# Altium project parallella_schematic.PrjPcb (part 3 of 3)

## Sheet 15-HDMI TRNSMITTER.SchDoc
size 513 x 386 mm
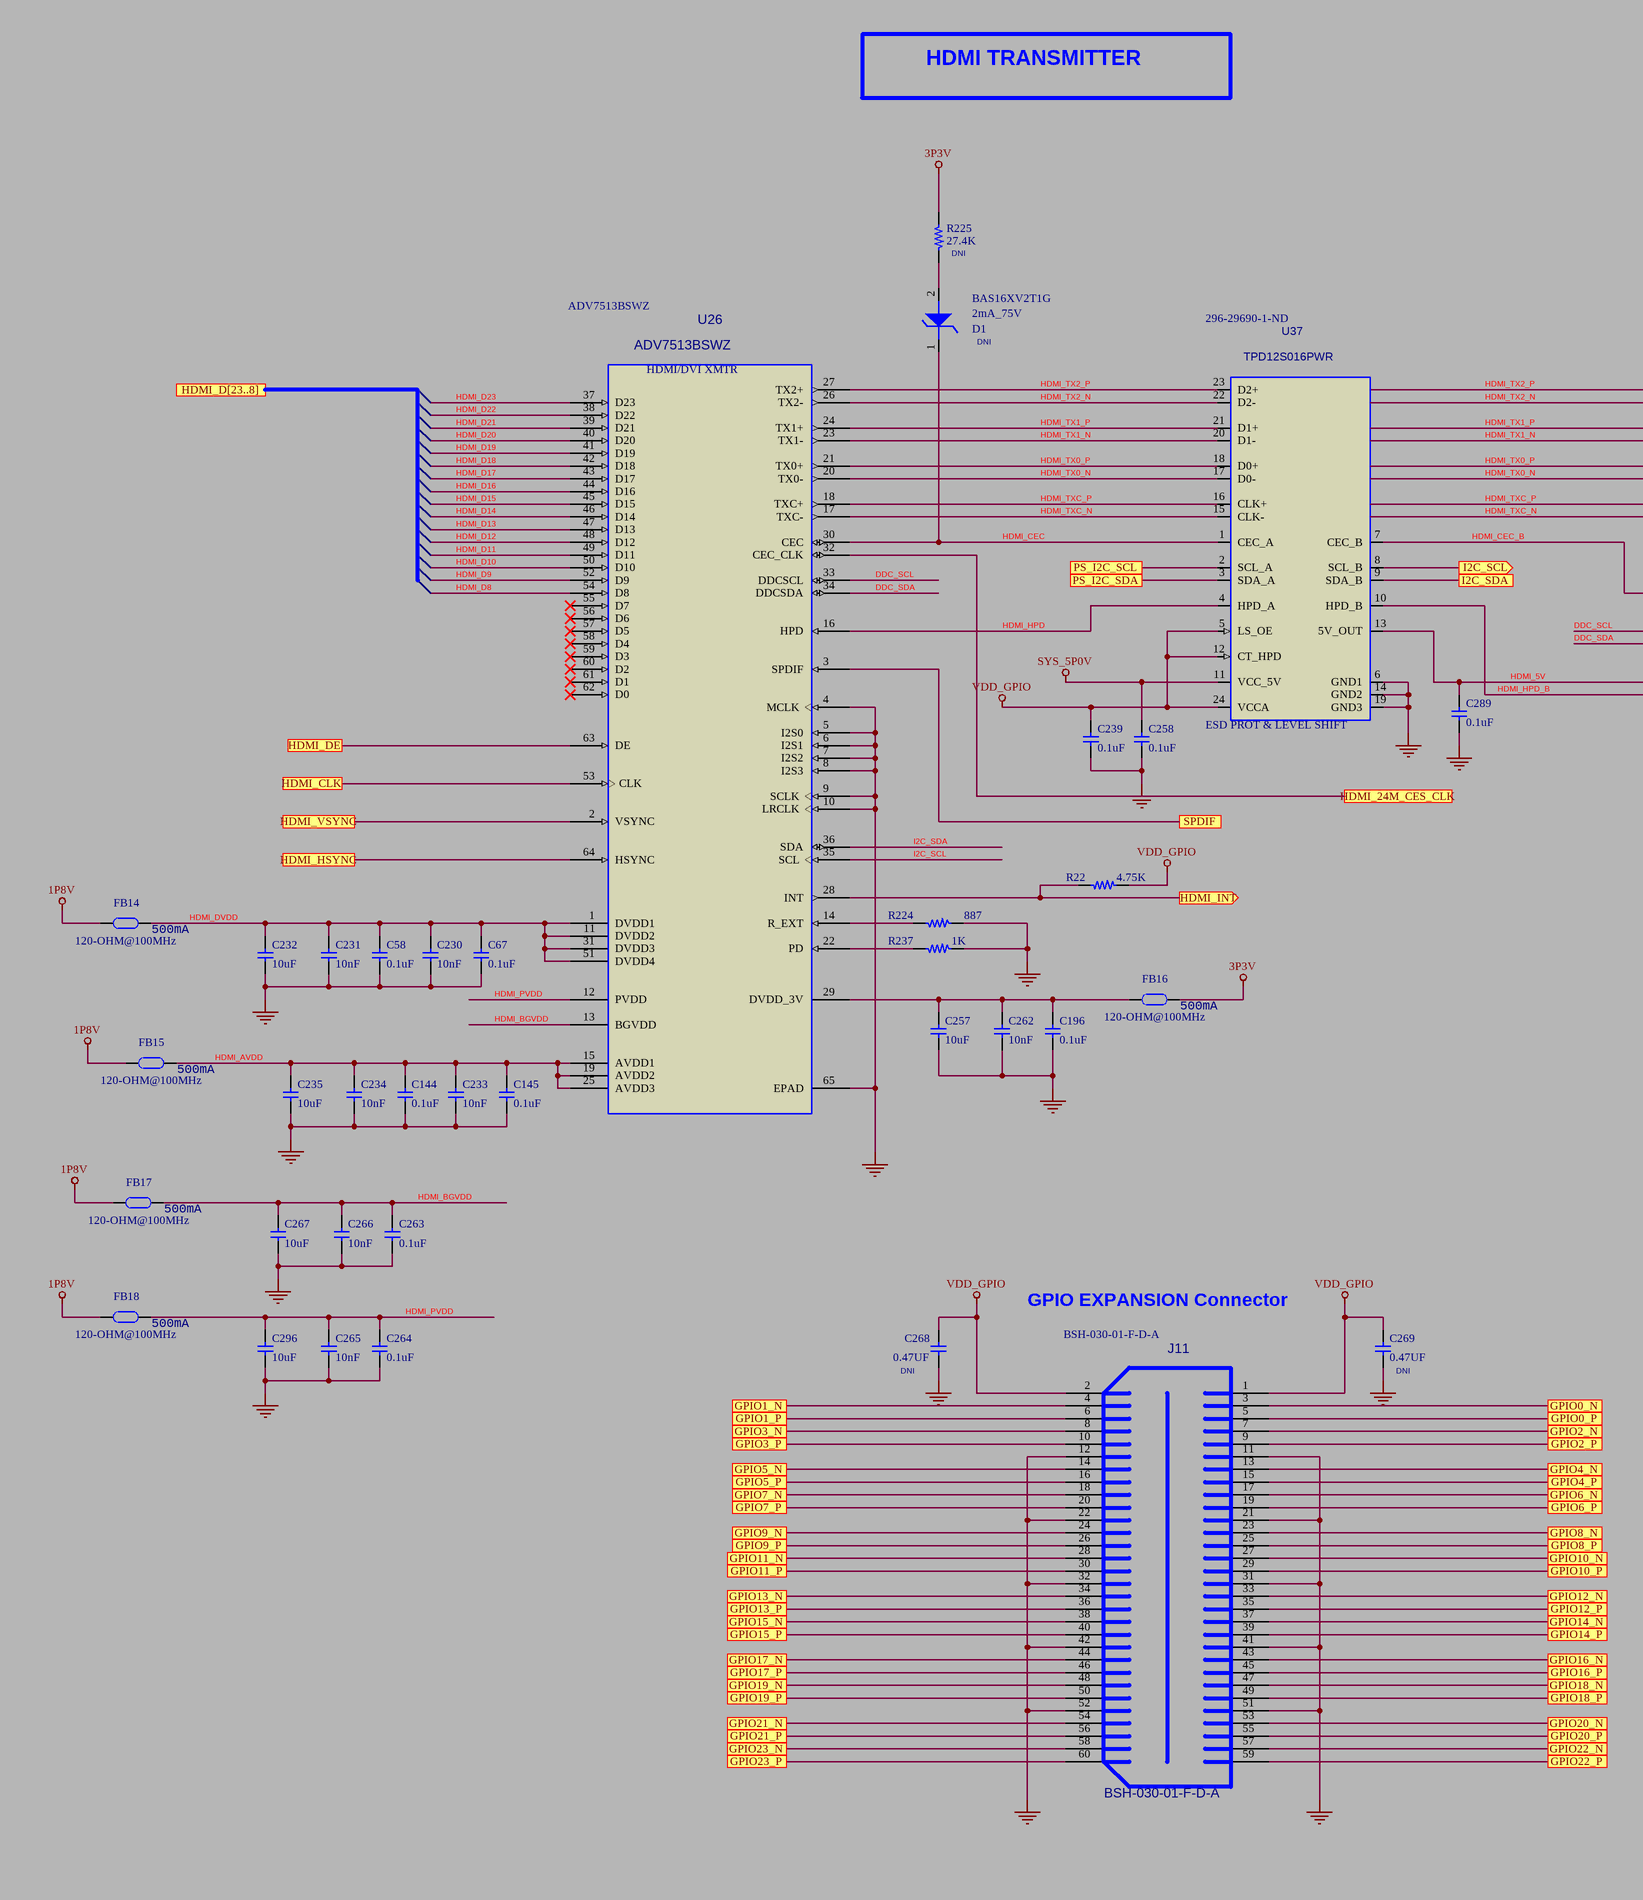
[diagram p19: 15-HDMI TRNSMITTER.SchDoc, left]
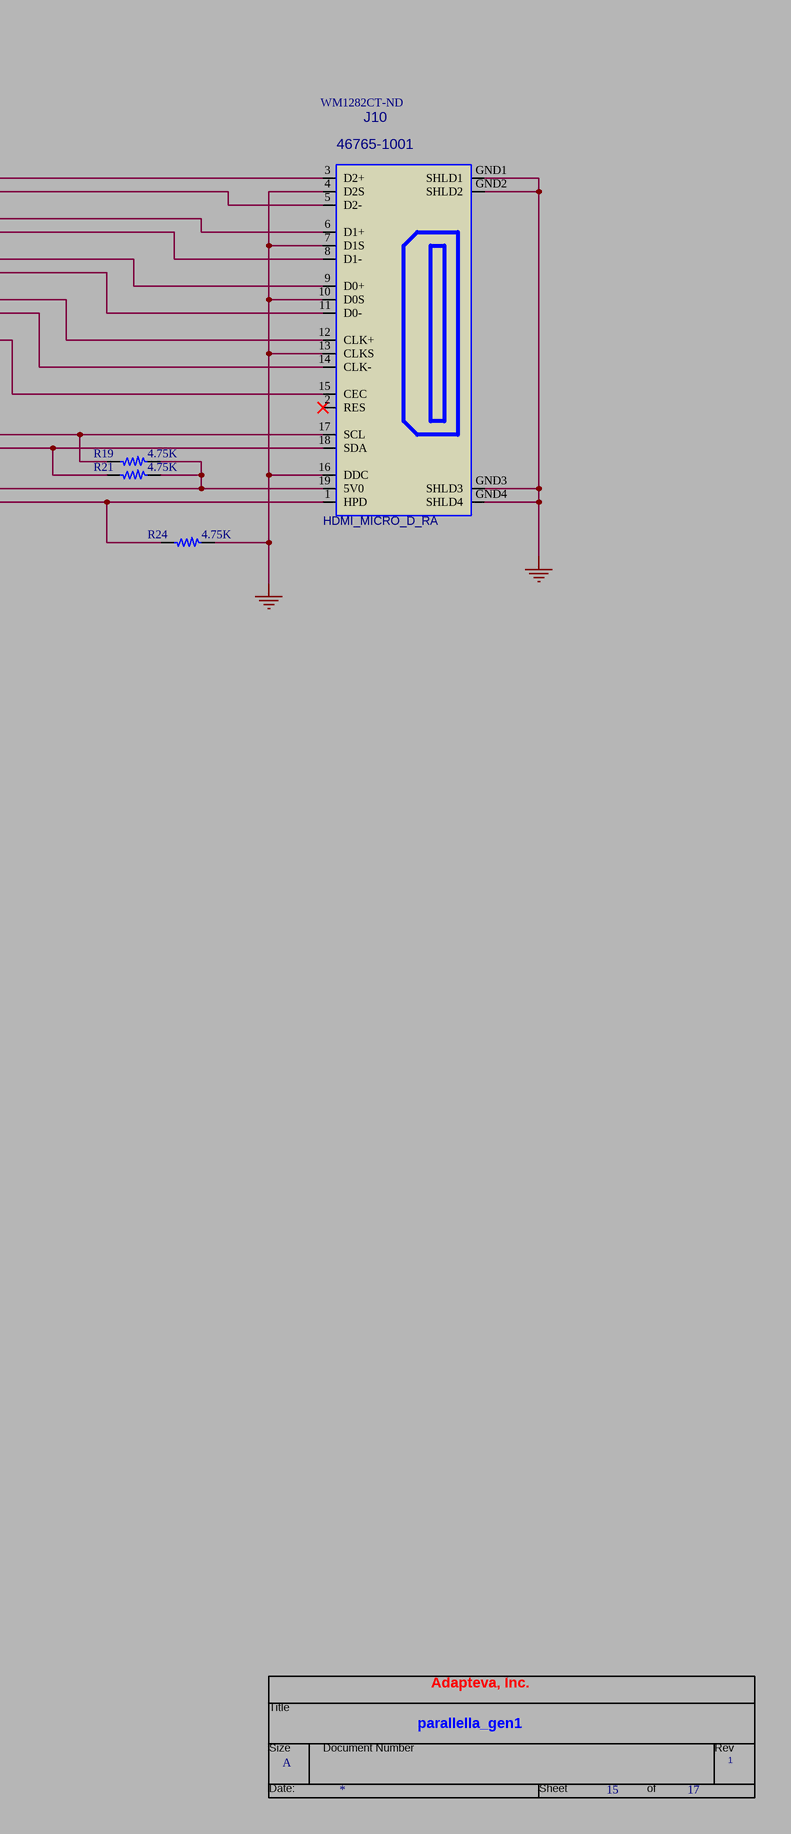
[diagram p20: 15-HDMI TRNSMITTER.SchDoc, right]

### Parts
(Parts that share a designator on the sheet are numbered #1, #2 ... from top to bottom, then left to right.)
*#15  RevCode: 1  Title: parallella_gen1  Page Size: A  Page Number: 15  Page Count: 17  OrgAddr1: Adapteva, Inc.  (hidden comment: TitleBlock0)  (graphical)
C58  0.1uF  [C0402]
C67  0.1uF  [C0402]
C144  0.1uF  [C0402]
C145  0.1uF  [C0402]
C196  0.1uF  [C0402]
C230  10nF  [C0402]
C231  10nF  [C0402]
C232  10uF  [C0603]
C233  10nF  [C0402]
C234  10nF  [C0402]
C235  10uF  [C0603]
C239  0.1uF  [C0402]
C257  10uF  [C0603]
C258  0.1uF  [C0402]
C262  10nF  [C0402]
C263  0.1uF  [C0402]
C264  0.1uF  [C0402]
C265  10nF  [C0402]
C266  10nF  [C0402]
C267  10uF  [C0603]
C268  0.47UF  INSTALL: DNI  [C0402]
C269  0.47UF  INSTALL: DNI  [C0402]
C289  0.1uF  [C0402]
C296  10uF  [C0603]
D1  2mA_75V  Vendor PN: BAS16XV2T1G  INSTALL: DNI  [SOD-523]
FB14  120-OHM@100MHz  [FBEAD_0402]
FB15  120-OHM@100MHz  [FBEAD_0402]
FB16  120-OHM@100MHz  [FBEAD_0402]
FB17  120-OHM@100MHz  [FBEAD_0402]
FB18  120-OHM@100MHz  [FBEAD_0402]
J10  HDMI_MICRO_D_RA  MFG PART NO: 46765-1001  Supplier Part Number 1: WM1282CT-ND  [HDMI_MICRO19_6P5X7P5X2P9H_P4P]
J11  BSH-030-01-F-D-A  [CONN_BSH60P_13P59X25P88_P5P_V]
R19  4.75K  [R0402]
R21  4.75K  [R0402]
R22  4.75K  [R0402]
R24  4.75K  [R0402]
R224  887  [R0402]
R225  27.4K  INSTALL: DNI  [R0402]
R237  1K  [R0402]
U26  HDMI/DVI XMTR  Vendor PN: ADV7513BSWZ  [LQFP64_10SQX1P6MMH_P5MMP]
U37  ESD PROT & LEVEL SHIFT  MFG PART NO: TPD12S016PWR  Supplier Part Number 1: 296-29690-1-ND  [TSSOP24_6P4X7P9X1P2MMH_P65P]

### Ports
GPIO0_N, GPIO0_P, GPIO1_N, GPIO1_P, GPIO2_N, GPIO2_P, GPIO3_N, GPIO3_P, GPIO4_N, GPIO4_P, GPIO5_N, GPIO5_P, GPIO6_N, GPIO6_P, GPIO7_N, GPIO7_P, GPIO8_N, GPIO8_P, GPIO9_N, GPIO9_P, GPIO10_N, GPIO10_P, GPIO11_N, GPIO11_P, GPIO12_N, GPIO12_P, GPIO13_N, GPIO13_P, GPIO14_N, GPIO14_P, GPIO15_N, GPIO15_P, GPIO16_N, GPIO16_P, GPIO17_N, GPIO17_P, GPIO18_N, GPIO18_P, GPIO19_N, GPIO19_P, GPIO20_N, GPIO20_P, GPIO21_N, GPIO21_P, GPIO22_N, GPIO22_P, GPIO23_N, GPIO23_P, HDMI_24M_CES_CLK, HDMI_CLK, HDMI_D[23..8], HDMI_DE, HDMI_HSYNC, HDMI_INT (out), HDMI_VSYNC, I2C_SCL (out), I2C_SDA, PS_I2C_SCL, PS_I2C_SDA, SPDIF

### Nets
1P8V: FB14.1 FB15.1 FB17.1 FB18.1
3P3V: FB16.2 R225.1
GND: C58.2 C67.2 C144.2 C145.2 C196.2 C230.2 C231.2 C232.2 C233.2 C234.2 C235.2 C239.2 C257.2 C258.2 C262.2 C263.2 C264.2 C265.2 C266.2 C267.2 C268.2 C269.2 C289.2 C296.2 J10.4(D2S) J10.7(D1S) J10.10(D0S) J10.13(CLKS) J10.16(DDC) J10.GND1(SHLD1) J10.GND2(SHLD2) J10.GND3(SHLD3) J10.GND4(SHLD4) J11.11 J11.12 J11.21 J11.22 J11.31 J11.32 J11.41 J11.42 J11.51 J11.52 R24.2 R224.2 R237.2 U26.4(MCLK) U26.5(I2S0) U26.6(I2S1) U26.7(I2S2) U26.8(I2S3) U26.9(SCLK) U26.10(LRCLK) U26.65(EPAD) U37.6(GND1) U37.14(GND2) U37.19(GND3)  [project net PHY_DIS_REG10]
SYS_5P0V: C258.1 U37.11(VCC_5V)
VDD_GPIO: C239.1 C268.1 C269.1 J11.1 J11.2 R22.2 U37.5(LS_OE) U37.12(CT_HPD) U37.24(VCCA)
DDC_SCL: J10.17(SCL) R19.1 U26.33(DDCSCL)
DDC_SDA: J10.18(SDA) R21.1 U26.34(DDCSDA)
HDMI_5V: C289.1 J10.19(5V0) R19.2 R21.2 U37.13(5V_OUT)
HDMI_AVDD: C144.1 C145.1 C233.1 C234.1 C235.1 FB15.2 U26.15(AVDD1) U26.19(AVDD2) U26.25(AVDD3)
HDMI_BGVDD: C263.1 C266.1 C267.1 FB17.2 U26.13(BGVDD)
HDMI_CEC: D1.1(CATHODE) U26.30(CEC) U37.1(CEC_A)
HDMI_CEC_B: J10.15(CEC) U37.7(CEC_B)
HDMI_D8: U26.54(D8)
HDMI_D9: U26.52(D9)
HDMI_D10: U26.50(D10)
HDMI_D11: U26.49(D11)
HDMI_D12: U26.48(D12)
HDMI_D13: U26.47(D13)
HDMI_D14: U26.46(D14)
HDMI_D15: U26.45(D15)
HDMI_D16: U26.44(D16)
HDMI_D17: U26.43(D17)
HDMI_D18: U26.42(D18)
HDMI_D19: U26.41(D19)
HDMI_D20: U26.40(D20)
HDMI_D21: U26.39(D21)
HDMI_D22: U26.38(D22)
HDMI_D23: U26.37(D23)
HDMI_DVDD: C58.1 C67.1 C230.1 C231.1 C232.1 FB14.2 U26.1(DVDD1) U26.11(DVDD2) U26.31(DVDD3) U26.51(DVDD4)
HDMI_HPD: U26.16(HPD) U37.4(HPD_A)
HDMI_HPD_B: J10.1(HPD) R24.1 U37.10(HPD_B)
HDMI_PVDD: C264.1 C265.1 C296.1 FB18.2 U26.12(PVDD)
HDMI_TX0_N: J10.11(D0-) U26.20(TX0-) U37.17(D0-)
HDMI_TX0_P: J10.9(D0+) U26.21(TX0+) U37.18(D0+)
HDMI_TX1_N: J10.8(D1-) U26.23(TX1-) U37.20(D1-)
HDMI_TX1_P: J10.6(D1+) U26.24(TX1+) U37.21(D1+)
HDMI_TX2_N: J10.5(D2-) U26.26(TX2-) U37.22(D2-)
HDMI_TX2_P: J10.3(D2+) U26.27(TX2+) U37.23(D2+)
HDMI_TXC_N: J10.14(CLK-) U26.17(TXC-) U37.15(CLK-)
HDMI_TXC_P: J10.12(CLK+) U26.18(TXC+) U37.16(CLK+)
I2C_SCL: U26.35(SCL)
I2C_SDA: U26.36(SDA)
NetC196_1: C196.1 C257.1 C262.1 FB16.1 U26.29(DVDD_3V)
NetD1_2: D1.2(ANODE) R225.2
NetJ11_3: J11.3 ; port GPIO0_N
NetJ11_4: J11.4 ; port GPIO1_N
NetJ11_5: J11.5 ; port GPIO0_P
NetJ11_6: J11.6 ; port GPIO1_P
NetJ11_7: J11.7 ; port GPIO2_N
NetJ11_8: J11.8 ; port GPIO3_N
NetJ11_9: J11.9 ; port GPIO2_P
NetJ11_10: J11.10 ; port GPIO3_P
NetJ11_13: J11.13 ; port GPIO4_N
NetJ11_14: J11.14 ; port GPIO5_N
NetJ11_15: J11.15 ; port GPIO4_P
NetJ11_16: J11.16 ; port GPIO5_P
NetJ11_17: J11.17 ; port GPIO6_N
NetJ11_18: J11.18 ; port GPIO7_N
NetJ11_19: J11.19 ; port GPIO6_P
NetJ11_20: J11.20 ; port GPIO7_P
NetJ11_23: J11.23 ; port GPIO8_N
NetJ11_24: J11.24 ; port GPIO9_N
NetJ11_25: J11.25 ; port GPIO8_P
NetJ11_26: J11.26 ; port GPIO9_P
NetJ11_27: J11.27 ; port GPIO10_N
NetJ11_28: J11.28 ; port GPIO11_N
NetJ11_29: J11.29 ; port GPIO10_P
NetJ11_30: J11.30 ; port GPIO11_P
NetJ11_33: J11.33 ; port GPIO12_N
NetJ11_34: J11.34 ; port GPIO13_N
NetJ11_35: J11.35 ; port GPIO12_P
NetJ11_36: J11.36 ; port GPIO13_P
NetJ11_37: J11.37 ; port GPIO14_N
NetJ11_38: J11.38 ; port GPIO15_N
NetJ11_39: J11.39 ; port GPIO14_P
NetJ11_40: J11.40 ; port GPIO15_P
NetJ11_43: J11.43 ; port GPIO16_N
NetJ11_44: J11.44 ; port GPIO17_N
NetJ11_45: J11.45 ; port GPIO16_P
NetJ11_46: J11.46 ; port GPIO17_P
NetJ11_47: J11.47 ; port GPIO18_N
NetJ11_48: J11.48 ; port GPIO19_N
NetJ11_49: J11.49 ; port GPIO18_P
NetJ11_50: J11.50 ; port GPIO19_P
NetJ11_53: J11.53 ; port GPIO20_N
NetJ11_54: J11.54 ; port GPIO21_N
NetJ11_55: J11.55 ; port GPIO20_P
NetJ11_56: J11.56 ; port GPIO21_P
NetJ11_57: J11.57 ; port GPIO22_N
NetJ11_58: J11.58 ; port GPIO23_N
NetJ11_59: J11.59 ; port GPIO22_P
NetJ11_60: J11.60 ; port GPIO23_P
NetJ13_3: U37.8(SCL_B) ; port I2C_SCL
NetJ13_4: U37.9(SDA_B) ; port I2C_SDA
NetJ13_27: U26.3(SPDIF) ; port SPDIF
NetR18_2: U37.3(SDA_A) ; port PS_I2C_SDA
NetR20_2: U37.2(SCL_A) ; port PS_I2C_SCL
NetR22_1: R22.1 U26.28(INT) ; port HDMI_INT
NetR41_2: U26.53(CLK) ; port HDMI_CLK
NetR42_2: U26.2(VSYNC) ; port HDMI_VSYNC
NetR44_2: U26.64(HSYNC) ; port HDMI_HSYNC
NetR94_2: U26.63(DE) ; port HDMI_DE
NetR114_2: U26.32(CEC_CLK) ; port HDMI_24M_CES_CLK
NetR224_1: R224.1 U26.14(R_EXT)
NetR237_1: R237.1 U26.22(PD)

Not connected (* = marked no-connect by the designer): J10 2(RES)*; U26 55(D7)* 56(D6)* 57(D5)* 58(D4)* 59(D3)* 60(D2)* 61(D1)* 62(D0)*

### Notes on the sheet
- HDMI TRANSMITTER
- GPIO EXPANSION Connector
- (in symbol BLM15AG121SN1D) 500mA
- (in symbol TitleBlock0) Title; Size; Document Number; Rev; Date:; Sheet; of

### Library data of the parts
C58 C67 C144 C145 C196 C239 C258 C263 C264 C289 = CAP0402_0P1UF_X5R_35V: as C297 on sheet 11-DSP PROCESSOR 1-OF-3; DEVICE: CAP0402_0P1UF_X5R_35V; MFG PART NO: GMK105BJ104KV-F; MFG: TAIYO YUDEN; PCB Footprint: C0402
C230 C231 C233 C234 C262 C265 C266 = CAP0402_10NF_X7R_16V: CAP, 0402, 10NF, X7R, 16V; MFG PART NO: C1005X7R1C103K; MFG: TDK; ALT_SYMBOLS: C0402_BGA; Vendor: TDK; Vendor PN: C1005X7R1C103K; PCB Footprint: C0402
C232 C235 C257 C267 C296 = CAP0603_10UF_X5R: CAP, 0603, 10UF, X5R, 10V; MFG PART NO: LMK107BJ106MALTD; MFG: TAIYO YUDEN; DEVICE: CAP0603_10UF_X5R; Vendor: TAIYO YUDEN; Vendor PN: LMK107BJ106MALTD; PCB Footprint: C0603
C268 C269 = CAP0402_0P47UF_X5R: as C154-C160 on sheet 10-ZYNQ PWR & GND; DEVICE: CAP0402_0P47UF_X5R; Vendor: TDK; Vendor PN: C1005X5R1C474K; PCB Footprint: C0402
D1 = DIODE_BAS16XV2T1G: DIODE, SWITCH, 200mA, 75V, SOD523; MFG: ON SEMICONDUCTOR; MFG PART NO: BAS16XV2T1G; DEVICE: DIODE_BAS16XV2T1G; Vendor: ON SEMICONDUCTOR; PCB Footprint: SOD-523
FB14-FB18 = BLM15AG121SN1D: FERRITE, BEAD, 0402, 120 OHM@ 100MHZ, 500mA, SMT; Vendor: MURATA; Vendor PN: BLM15AG121SN1D; DEVICE: BLM15AG121SN1D; MFG: MURATA; MFG PART NO: BLM15AG121SN1D; PCB Footprint: FBEAD_0402
J10 = HDMI_MICRO_D_RA_SMT: CONN, HDMI, RCPT, MICRO D, RA, SMT; Vendor: MOLEX; Vendor PN: 46765-1001; DEVICE: HDMI_MICRO_D_RA_SMT; MFG: MOLEX; PCB Footprint: HDMI_MICRO19_6P5X7P5X2P9H_P4P; Supplier 1: Digi-Key
J11 = CON_BSH_030_VERT: Vendor: SAMTEC; Vendor PN: BSH-030-01-F-D-A; DEVICE: CON_BSH_030_VERT; PCB Footprint: CONN_BSH60P_13P59X25P88_P5P_V; Supplier 1: Arrow; Supplier Part Number 1: BSH-030-01-F-D-A
R19 R21 R22 R24 = RES0402_4K75: as R156-R159 on sheet 11-DSP PROCESSOR 1-OF-3; DEVICE: RES0402_4K75; Vendor PN: CRCW04024K75FKED; PCB Footprint: R0402
R224 = RES0402_887: RES, 0402, 887; Vendor PN: CRCW0402887RFKED; Vendor: VISHAY/DALE; MFG: VISHAY; ALY_SYMBOLS: R0402_BGA; MFG PART NO: CRCW0402887RFKED; DEVICE: RES0402_887; PCB Footprint: R0402
R225 = RES0402_27K4: RES, 0402, 27.4K; Vendor PN: CRCW040227K4FKED; Vendor: VISHAY/DALE; MFG: VISHAY; ALT_SYMBOLS: R0402_BGA; MFG PART NO: CRCW040227K4FKED; DEVICE: RES0402_27K4; PCB Footprint: R0402
R237 = RES0402_1K: as R160 on sheet 11-DSP PROCESSOR 1-OF-3; DEVICE: RES0402_1K; Vendor PN: CRCW04021K00FKED; PCB Footprint: R0402
U26 = HDMI_DVI_XCVR_ADV7513: IC, HDMI/DVI TRANSMITTER, PQFP64; Vendor: ANALOG DEVICES; DEVICE: HDMI_DVI_XCVR_ADV7513; Supplier 1: Arrow; Supplier Part Number 1: ADV7513BSWZ
U37 = TPD12S016: IC, HDMI ESD PROT AND LEVEL SHIFT, TSSOP24; Vendor: TEXAS INSTRUMENTS; Vendor PN: TPD12S016PWR; DEVICE: TPD12S016; MFG: TEXAS INSTRUMENTS; PCB Footprint: TSSOP24_6P4X7P9X1P2MMH_P65P; Supplier 1: Digi-Key
*#15 = TitleBlock0: Page Create Date: March  8, 1995; Page Modify Date: *

## Sheet 16-POWER MANAGEMENT.SchDoc
size 513 x 386 mm
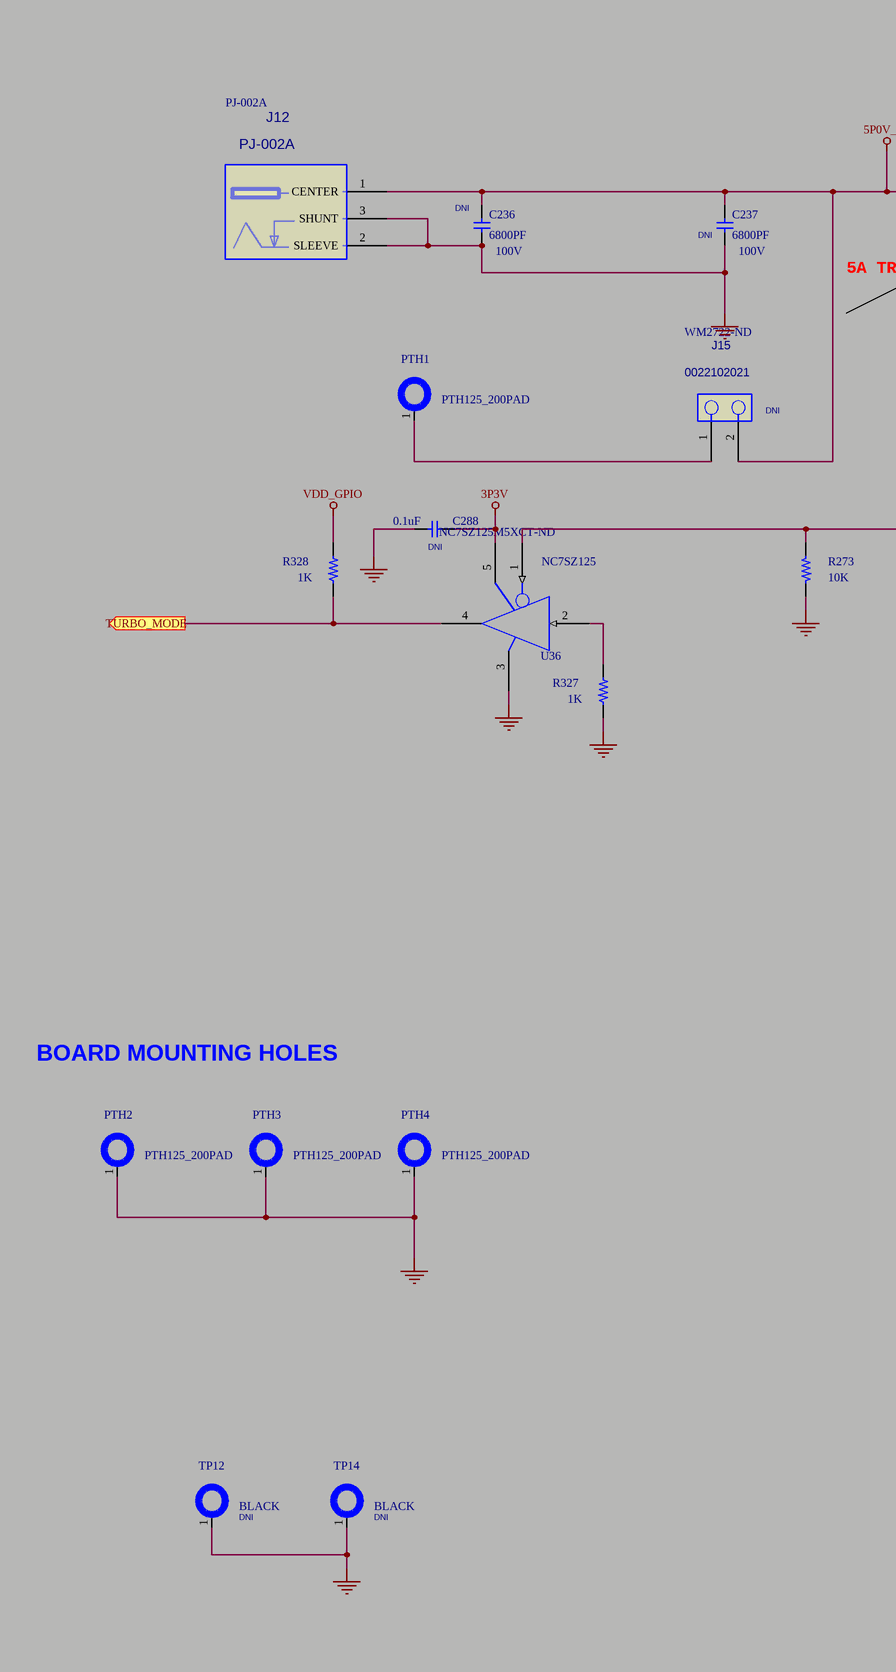
[diagram p21: 16-POWER MANAGEMENT.SchDoc, left]
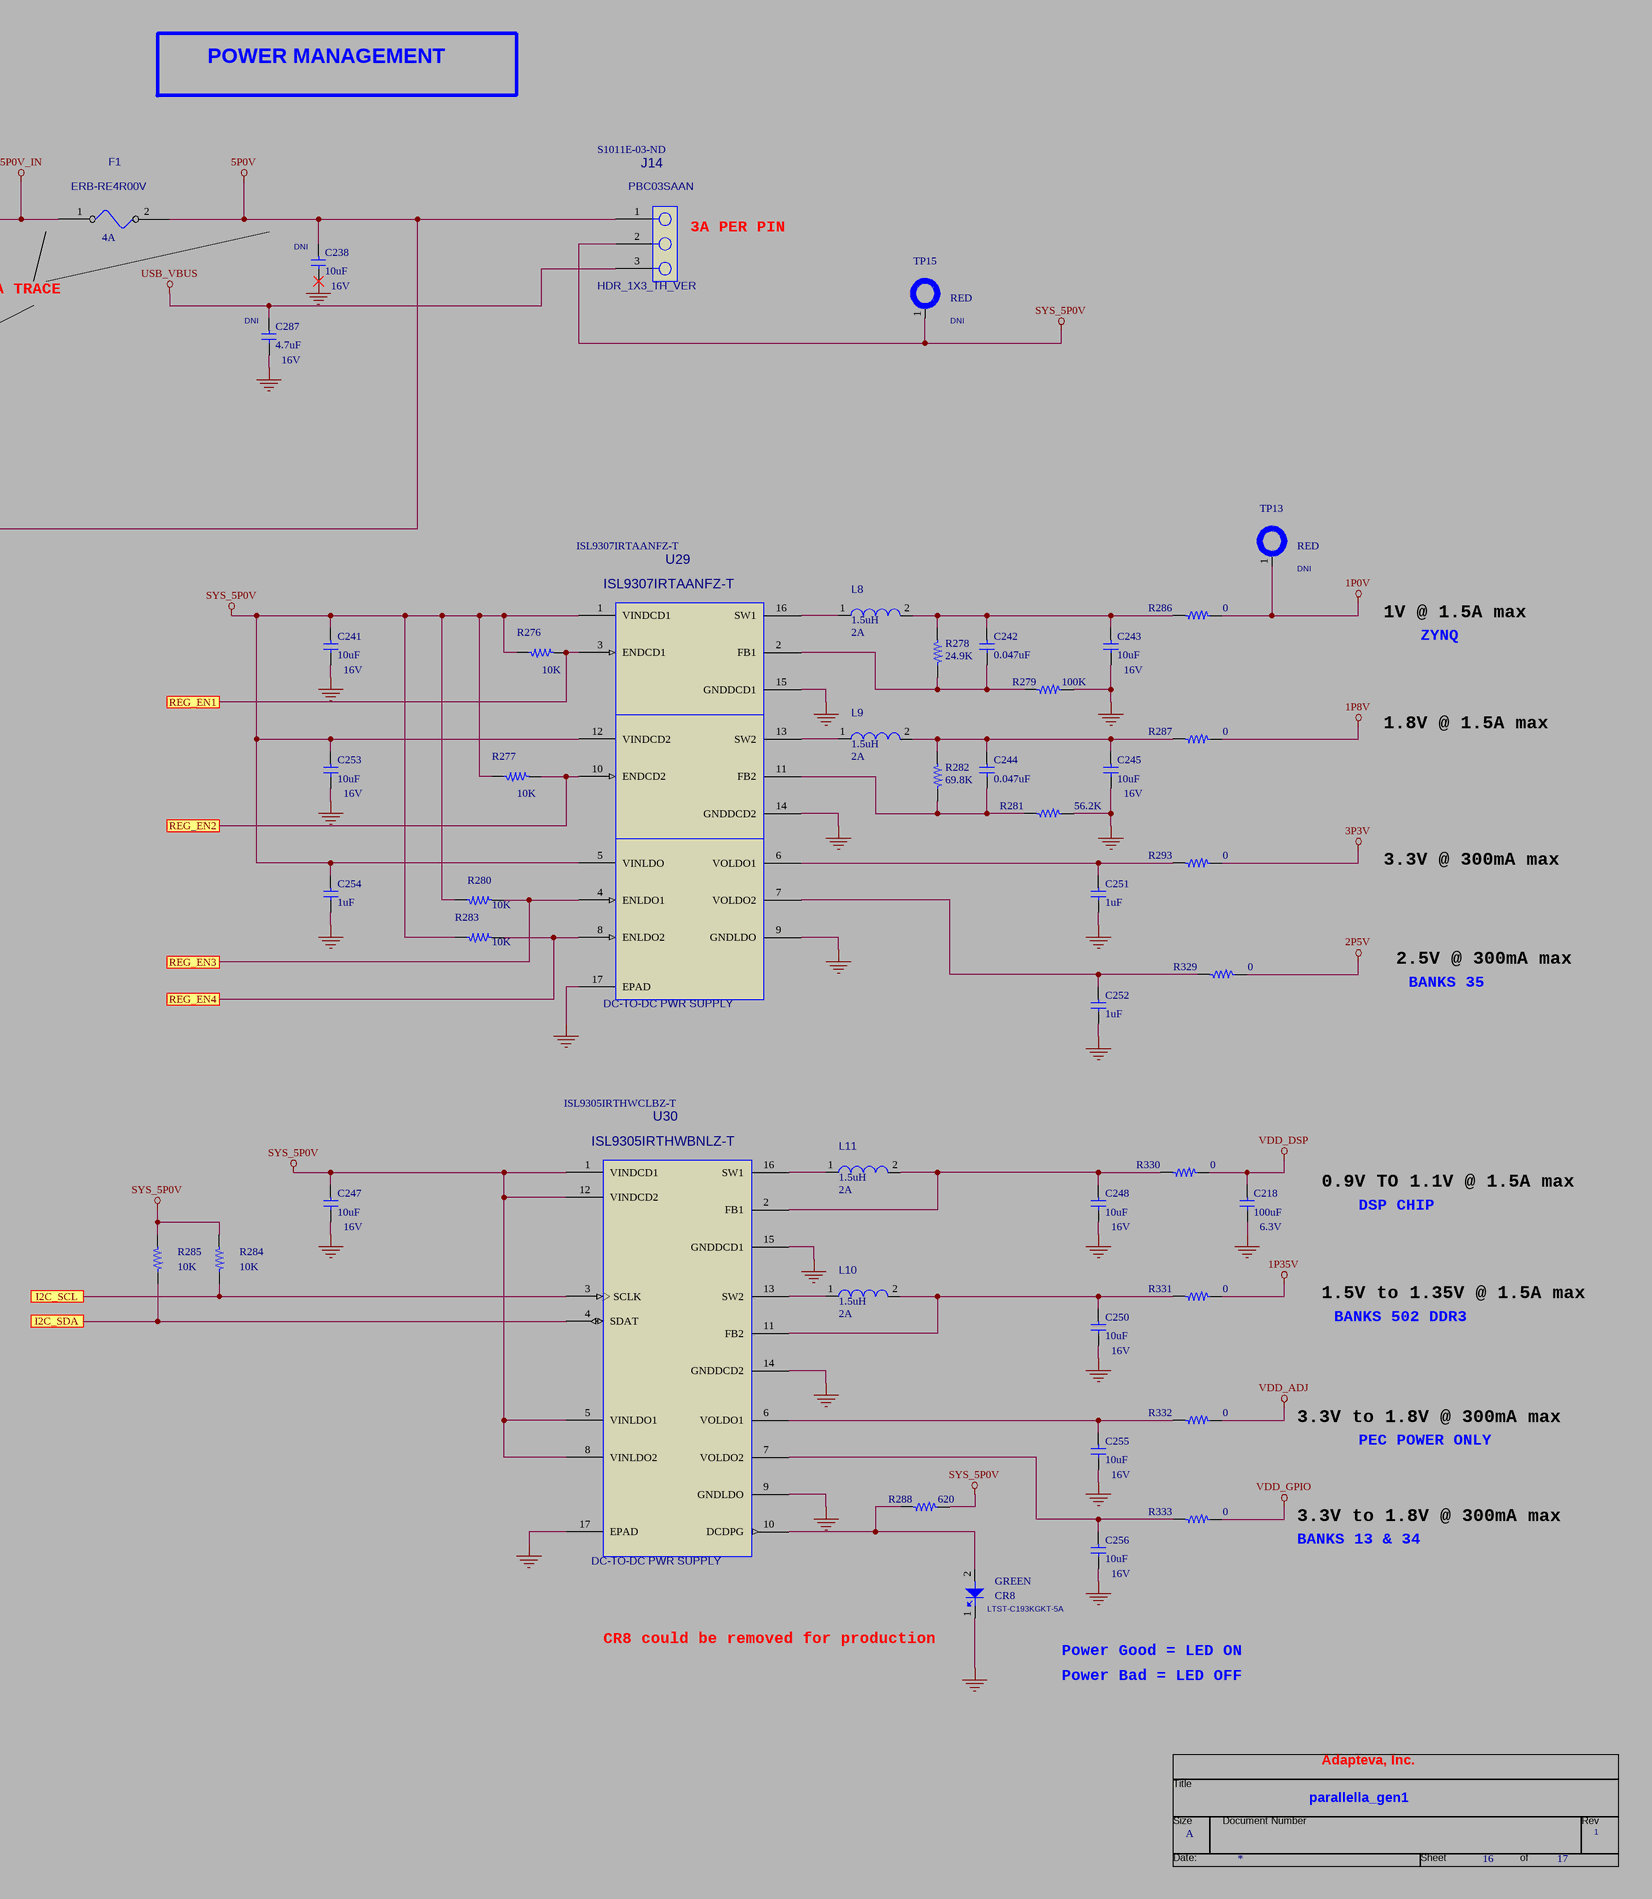
[diagram p22: 16-POWER MANAGEMENT.SchDoc, right]

### Parts
(Parts that share a designator on the sheet are numbered #1, #2 ... from top to bottom, then left to right.)
*#16  RevCode: 1  Title: parallella_gen1  Page Size: A  Page Number: 16  Page Count: 17  OrgAddr1: Adapteva, Inc.  (hidden comment: TitleBlock0)  (graphical)
C218  100uF  VOLTAGE: 6.3V  [C1210]
C236  6800PF  VOLTAGE: 100V  INSTALL: DNI  [C0805]
C237  6800PF  VOLTAGE: 100V  INSTALL: DNI  [C0805]
C238  10uF  VOLTAGE: 16V  INSTALL: DNI  [C0805]
C241  10uF  VOLTAGE: 16V  [C0805]
C242  0.047uF  [C0402]
C243  10uF  VOLTAGE: 16V  [C0805]
C244  0.047uF  [C0402]
C245  10uF  VOLTAGE: 16V  [C0805]
C247  10uF  VOLTAGE: 16V  [C0805]
C248  10uF  VOLTAGE: 16V  [C0805]
C250  10uF  VOLTAGE: 16V  [C0805]
C251  1uF  [C0603]
C252  1uF  [C0603]
C253  10uF  VOLTAGE: 16V  [C0805]
C254  1uF  [C0603]
C255  10uF  VOLTAGE: 16V  [C0805]
C256  10uF  VOLTAGE: 16V  [C0805]
C287  4.7uF  VOLTAGE: 16V  INSTALL: DNI  [C0603]
C288  0.1uF  INSTALL: DNI  [C0402]
CR8  GREEN  Vendor PN: LTST-C193KGKT-5A  [LED_0603]
F1  4A  Vendor PN: ERB-RE4R00V  [F0603]
J12  PJ-002A  [DC_PWR_JCK_9X14P4X11MMH]
J14  HDR_1X3_TH_VER  Vendor PN: PBC03SAAN  Supplier Part Number 1: S1011E-03-ND  [HDR_1X3_TH_VER]
J15  Vendor PN: 0022102021  INSTALL: DNI  Supplier Part Number 1: WM2722-ND  [HDR_1X2_TH_VER]  (hidden comment: HDR_1X2_TH_VER)
L8  1.5uH  CURRENT: 2A  [IND2_2X2P5X1P2MMH]
L9  1.5uH  CURRENT: 2A  [IND2_2X2P5X1P2MMH]
L10  1.5uH  CURRENT: 2A  [IND2_2X2P5X1P2MMH]
L11  1.5uH  CURRENT: 2A  [IND2_2X2P5X1P2MMH]
PTH1  PTH125_200PAD  [PTH125_200PAD]
PTH2  PTH125_200PAD  [PTH125_200PAD]
PTH3  PTH125_200PAD  [PTH125_200PAD]
PTH4  PTH125_200PAD  [PTH125_200PAD]
R273  10K  [R0402]
R276  10K  [R0402]
R277  10K  [R0402]
R278  24.9K  [R0603]
R279  100K  [R0603]
R280  10K  [R0402]
R281  56.2K  [R0402]
R282  69.8K  [R0603]
R283  10K  [R0402]
R284  10K  [R0402]
R285  10K  [R0402]
R286  0  [R0402]
R287  0  [R0402]
R288  620  [R0402]
R293  0  [R0402]
R327  1K  [R0402]
R328  1K  [R0402]
R329  0  [R0402]
R330  0  [R0402]
R331  0  [R0402]
R332  0  [R0402]
R333  0  [R0402]
TP12  BLACK  INSTALL: DNI  [TP55]
TP13  RED  INSTALL: DNI  [TP55]
TP14  BLACK  INSTALL: DNI  [TP55]
TP15  RED  INSTALL: DNI  [TP55]
U29  DC-TO-DC PWR SUPPLY  Vendor PN: ISL9307IRTAANFZ-T  [TQFN16_4SQXP75H_P65P]
U30  DC-TO-DC PWR SUPPLY  Vendor PN: ISL9305IRTHWBNLZ-T  Supplier Part Number 1: ISL9305IRTHWCLBZ-T  [TQFN16_4SQXP75H_P65P]
U36  NC7SZ125  Supplier Part Number 1: NC7SZ125M5XCT-ND  [SOT_5PIN]

### Ports
I2C_SCL, I2C_SDA, REG_EN1, REG_EN2, REG_EN3, REG_EN4, TURBO_MODE (out)

### Nets
1P0V: R286.2 TP13.1
1P8V: R287.2
1P35V: R331.2
2P5V: R329.2
3P3V: C288.2 R293.2 U36.5(VCC)
5P0V: C238.1 F1.2 J14.1 R273.1 U36.1(~{OE})
5P0V_IN: C236.1 C237.1 F1.1 J12.1(CENTER) J15.2
GND: C218.2 C236.2 C237.2 C238.2 C241.2 C243.2 C245.2 C247.2 C248.2 C250.2 C251.2 C252.2 C253.2 C254.2 C255.2 C256.2 C287.2 C288.1 CR8.1(C) J12.2(SLEEVE) J12.3(SHUNT) PTH2.1 PTH3.1 PTH4.1 R273.2 R279.2 R281.2 R327.2 TP12.1 TP14.1 U29.9(GNDLDO) U29.14(GNDDCD2) U29.15(GNDDCD1) U29.17(EPAD) U30.9(GNDLDO) U30.14(GNDDCD2) U30.15(GNDDCD1) U30.17(EPAD) U36.3(GND)  [project net PHY_DIS_REG10]
SYS_5P0V: C241.1 C247.1 C253.1 C254.1 J14.2 R276.2 R277.2 R280.2 R283.2 R284.1 R285.1 R288.2 TP15.1 U29.1(VINDCD1) U29.5(VINLDO) U29.12(VINDCD2) U30.1(VINDCD1) U30.5(VINLDO1) U30.8(VINLDO2) U30.12(VINDCD2)
USB_VBUS: C287.1 J14.3  [project net P1_VBUS]
VDD_ADJ: R332.2
VDD_DSP: C218.1 R330.2
VDD_GPIO: R328.1 R333.2
NetC242_1: C242.1 C243.1 L8.2 R278.1 R286.1
NetC242_2: C242.2 R278.2 R279.1 U29.2(FB1)
NetC244_1: C244.1 C245.1 L9.2 R282.1 R287.1
NetC244_2: C244.2 R281.1 R282.2 U29.11(FB2)
NetC248_1: C248.1 L11.2 R330.1 U30.2(FB1)
NetC250_1: C250.1 L10.2 R331.1 U30.11(FB2)
NetC251_1: C251.1 R293.1 U29.6(VOLDO1)
NetC252_1: C252.1 R329.1 U29.7(VOLDO2)
NetC255_1: C255.1 R332.1 U30.6(VOLDO1)
NetC256_1: C256.1 R333.1 U30.7(VOLDO2)
NetCR8_2: CR8.2(A) R288.1 U30.10(DCDPG)
NetJ13_3: R284.2 U30.3(SCLK) ; port I2C_SCL
NetJ13_4: R285.2 U30.4(SDAT) ; port I2C_SDA
NetJ13_5: R276.1 U29.3(ENDCD1) ; port REG_EN1
NetJ13_6: R277.1 U29.10(ENDCD2) ; port REG_EN2
NetJ13_7: R280.1 U29.4(ENLDO1) ; port REG_EN3
NetJ13_8: R283.1 U29.8(ENLDO2) ; port REG_EN4
NetJ13_25: R328.2 U36.4(Y) ; port TURBO_MODE
NetJ15_1: J15.1 PTH1.1
NetL8_1: L8.1 U29.16(SW1)
NetL9_1: L9.1 U29.13(SW2)
NetL10_1: L10.1 U30.13(SW2)
NetL11_1: L11.1 U30.16(SW1)
NetR327_1: R327.1 U36.2(A)

### Notes on the sheet
- POWER MANAGEMENT
- (near J14) 3A PER PIN
- 5A TRACE
- 1V @ 1.5A max
- ZYNQ
- 1.8V @ 1.5A max
- 3.3V @ 300mA max
- 2.5V @ 300mA max
- BOARD MOUNTING HOLES
- BANKS 35
- 0.9V TO 1.1V @ 1.5A max
- DSP CHIP
- 1.5V to 1.35V @ 1.5A max
- BANKS 502 DDR3
- 3.3V to 1.8V @ 300mA max
- PEC POWER ONLY
- BANKS 13 & 34
- CR8 could be removed for production
- Power Good = LED ON
- Power Bad = LED OFF
- (in symbol TitleBlock0) Title; Size; Document Number; Rev; Date:; Sheet; of

### Library data of the parts
C218 = CAP1210_100UF_X5R_LOESR: CAP, 1210, 100UF, X5R, 6.3V, LOW ESR; MFG PART NO: GRM32ER60J107ME20L; MFG: MURATA; DEVICE: CAP1210_100UF_X5R_LOESR; Vendor: MURATA; Vendor PN: GRM32ER60J107ME20L; PCB Footprint: C1210
C236 C237 = CAP0805_6800PF_X7R: CAP, 0805, 6800PF, X7R, 100V; MFG PART NO: C2012X7R2A682KT5; MFG: TDK; DEVICE: CAP0805_6800PF_X7R; Vendor: TDK; Vendor PN: C2012X7R2A682KT5; PCB Footprint: C0805
C238 C241 C243 C245 C247 C248 C250 C253 C255 C256 = CAP0805_10UF_16V_X5R: CAP, 0805, 10UF, X5R, 16V; MFG PART NO: C2012X5R1C106M085AC; MFG: TDK; DEVICE: CAP0805_10UF_16V_X5R; Vendor: TDK; Vendor PN: C2012X5R1C106M085AC; PCB Footprint: C0805
C242 C244 = CAP0402_0P047UF_X5R: CAP, 0402, 0.047UF, X5R, 25V; MFG PART NO: C1005X5R1E473M; MFG: TDK; DEVICE: CAP0402_0P047UF_X5R; Vendor: TDK; Vendor PN: C1005X5R1E473M; PCB Footprint: C0402
C251 C252 C254 = CAP1UF_X5R: CAP, 0603, 1UF, X5R, 16V; Vendor PN: C0603C105K4PAC; Vendor: KEMET; DEVICE: CAP0603; MFG PART NO: C0603C105K4PAC; MFG: KEMET; PCB Footprint: C0603
C287 = CAP0603_4P7UF_16V_X5R: CAP, 0603, 4.7UF, X5R, 16V; MFG PART NO: C1608X5R1C475K080AC; MFG: TDK; DEVICE: CAP0603_4P7UF_16V_X5R; Vendor: TDK; Vendor PN: C1608X5R1C475K080AC; PCB Footprint: C0603
C288 = CAP0402_0P1UF_X5R_35V: CAP, 0402, 0.1UF, X5R, 35V; ALT_SYMBOLS: C0402_BGA; Vendor PN: GMK105BJ104KV-F; Vendor: TAIYO YUDEN; DEVICE: CAP0402_0P1UF_X5R_35V; MFG PART NO: GMK105BJ104KV-F; MFG: TAIYO YUDEN; PCB Footprint: C0402
CR8 = LED_0603_5MA_GRN: LED, 0603, 5MA, SMT, GREEN; Voltage: 2V; MFG: LITE-ON INC; MFG PART NO: LTST-C193KGKT-5A; Vendor: LITE-ON INC; PCB Footprint: LED_0603
F1 = FUSE0603_4A: FUSE, 4A, 32V, FAST, 0603; Vendor: PANASONIC; MFG PART NO: ERB-RE4R00V; MFG: PANASONIC; DEVICE: FUSE0603_4A; PCB Footprint: F0603
J12 = CON_POWER_PJ002A_TH: CON, PWR, BARREL, PCB, PJ002A_TH; Vendor: CUI; DEVICE: CON_POWER_PJ002A_TH; Vendor PN: PJ-002A; PCB Footprint: DC_PWR_JCK_9X14P4X11MMH; Supplier 1: Arrow; Supplier Part Number 1: PJ-002A
J14 = HDR_1X3_TH_VER_0.1P: HDR, 1ROW, 3POS, VERT, TH, 1X3, 0.100 PITCH; MFG PART NO: PBC36SAAN; Vendor: SULLINS; MFG: SULLINS; DEVICE: HDR_1X3_TH_VER_0.1P; PCB Footprint: HDR_1X3_TH_VER; Supplier 1: Digi-Key
J15 = HDR_1X2_TH_VER: HDR, 1ROW, 2POS, VERT, TH, 1X2; MFG: MOLEX; DEVICE: HDR_1X2_TH_VER; MFG PART NO: 0022102021; Vendor: MOLEX; PCB Footprint: HDR_1X2_TH_VER; Supplier 1: Digi-Key
L8-L11 = IND_1P5UH_2A: IND, 1.5uH, 2A; MFG PART NO: VLS252012ET-1R5N; MFG: TDK; DEVICE: IND_1P5UH_2A; Vendor: TDK; Vendor PN: VLS252012ET-1R5N; PCB Footprint: IND2_2X2P5X1P2MMH
R273 R276 R277 R280 R283-R285 = RES0402_10K: RES, 0402, 10K; MFG PART NO: CRCW040210K0FKED; ALT_SYMBOLS: R0402_BGA; MFG: VISHAY; Vendor: VISHAY/DALE; DEVICE: RES0402_10K; Vendor PN: CRCW040210K0FKED; PCB Footprint: R0402
R278 = RES0603_24K9: RES, 0603, 24.9K; Vendor PN: CRCW060324K9FKEA; Vendor: VISHAY/DALE; MFG PART NO: CRCW060324K9FKEA; MFG: VISHAY/DALE; DEVICE: RES0603_24K9; PCB Footprint: R0603
R279 = RES0603_100K: RES, 0603, 100K; Vendor PN: CRCW0603100KFKEA; Vendor: VISHAY/DALE; MFG: VISHAY/DALE; MFG PART NO: CRCW0603100KFKEA; DEVICE: RES0603_100K; PCB Footprint: R0603
R281 = RES0402_56K2: RES, 0402, 56.2K; Vendor PN: CRCW040256K2FKED; Vendor: VISHAY/DALE; MFG: VISHAY; ALY_SYMBOLS: R0402_BGA; MFG PART NO: CRCW040256K2FKED; DEVICE: RES0402_56K2; PCB Footprint: R0402
R282 = RES0603_69K8: RES, 0603, 69.8K; MFG PART NO: CRCW060369K8FKEA; MFG: VISHAY; DEVICE: RES0603_69K8; Vendor: VISHAY; Vendor PN: CRCW060369K8FKEA; PCB Footprint: R0603
R286 R287 R293 R329-R333 = RES0402_0: RES, 0402, 0 OHM, 1%; MFG PART NO: CRCW04020000Z0ED; ALT_SYMBOLS: R0402_BGA; MFG: VISHAY; Vendor: VISHAY/DALE; DEVICE: RES0402_0; Vendor PN: CRCW04020000Z0ED; PCB Footprint: R0402
R288 = RES0402_620: RES, 0402, 620, 1%; MFG PART NO: CRCW0402620RFKED; ALT_SYMBOLS: R0402_BGA; MFG: VISHAY; Vendor: VISHAY/DALE; DEVICE: RES0402_620; Vendor PN: CRCW0402620RFKED; PCB Footprint: R0402
R327 R328 = RES0402_1K: RES, 0402, 1K; MFG PART NO: CRCW04021K00FKED; ALT_SYMBOLS: R0402_BGA; MFG: VISHAY; Vendor: VISHAY/DALE; DEVICE: RES0402_1K; Vendor PN: CRCW04021K00FKED; PCB Footprint: R0402
TP12 TP14 = TEST_TERM_BLK: PC Test Point Miniature; Vendor PN: 5001; Vendor: Keystone; CLASS: IC; DEVICE: TEST_TERM_BLK; MFG: KEYSTONE; MFG PART NO: 5001; PCB Footprint: TP55
TP13 TP15 = TEST_TERM_RED: PC TEST POINT MINIATURE; MFG PART NO: 5000; MFG: KEYSTONE; CLASS: IC; DEVICE: TEST_TERM_RED; Vendor: KEYSTONE; Vendor PN: 5000; PCB Footprint: TP55
U29 = IC_ISL9307_DCDC_CONV: IC, dual step-down converters + dual LDOs, TQFN16; MFG: INTERSIL; MFG PART NO: ISL9307IRTAANFZ-T; Vendor: INTERSIL; DEVICE: IC_ISL9307_DCDC_CONV; PCB Footprint: TQFN16_4SQXP75H_P65P; Supplier 1: Avnet; Supplier Part Number 1: ISL9307IRTAANFZ-T
U30 = IC_ISL9305_DCDC_CONV: IC, dual step-down converters + dual LDOs, I2C interface, TQFN16; MFG: INTERSIL; MFG PART NO: ISL9305IRTHWCLBZ-T; Vendor: INTERSIL; DEVICE: IC_ISL9305_DCDC_CONV; PCB Footprint: TQFN16_4SQXP75H_P65P; Supplier 1: Avnet
U36 = NC7SZ125: PART_NUMBER: XXX-XXXXX-XX; Vendor PN: NC7SZ125M5X; VENDOR: FAIRCHILD; CLASS: IC; VENDOR_PN: NC7SZ125M5X; DEVICE: NC7SZ125; MFG: FAIRCHILD; MFG PART NO: NC7SZ125M5X; PCB Footprint: SOT_5PIN; Supplier 1: Digi-Key
*#16 = TitleBlock0: Page Create Date: March  8, 1995; Page Modify Date: *
PTH1-PTH4 = PTH125_200PAD: DEVICE: PTH125_200PAD; PCB Footprint: PTH125_200PAD

## Sheet 17-RESET GENERATION.SchDoc
size 513 x 386 mm
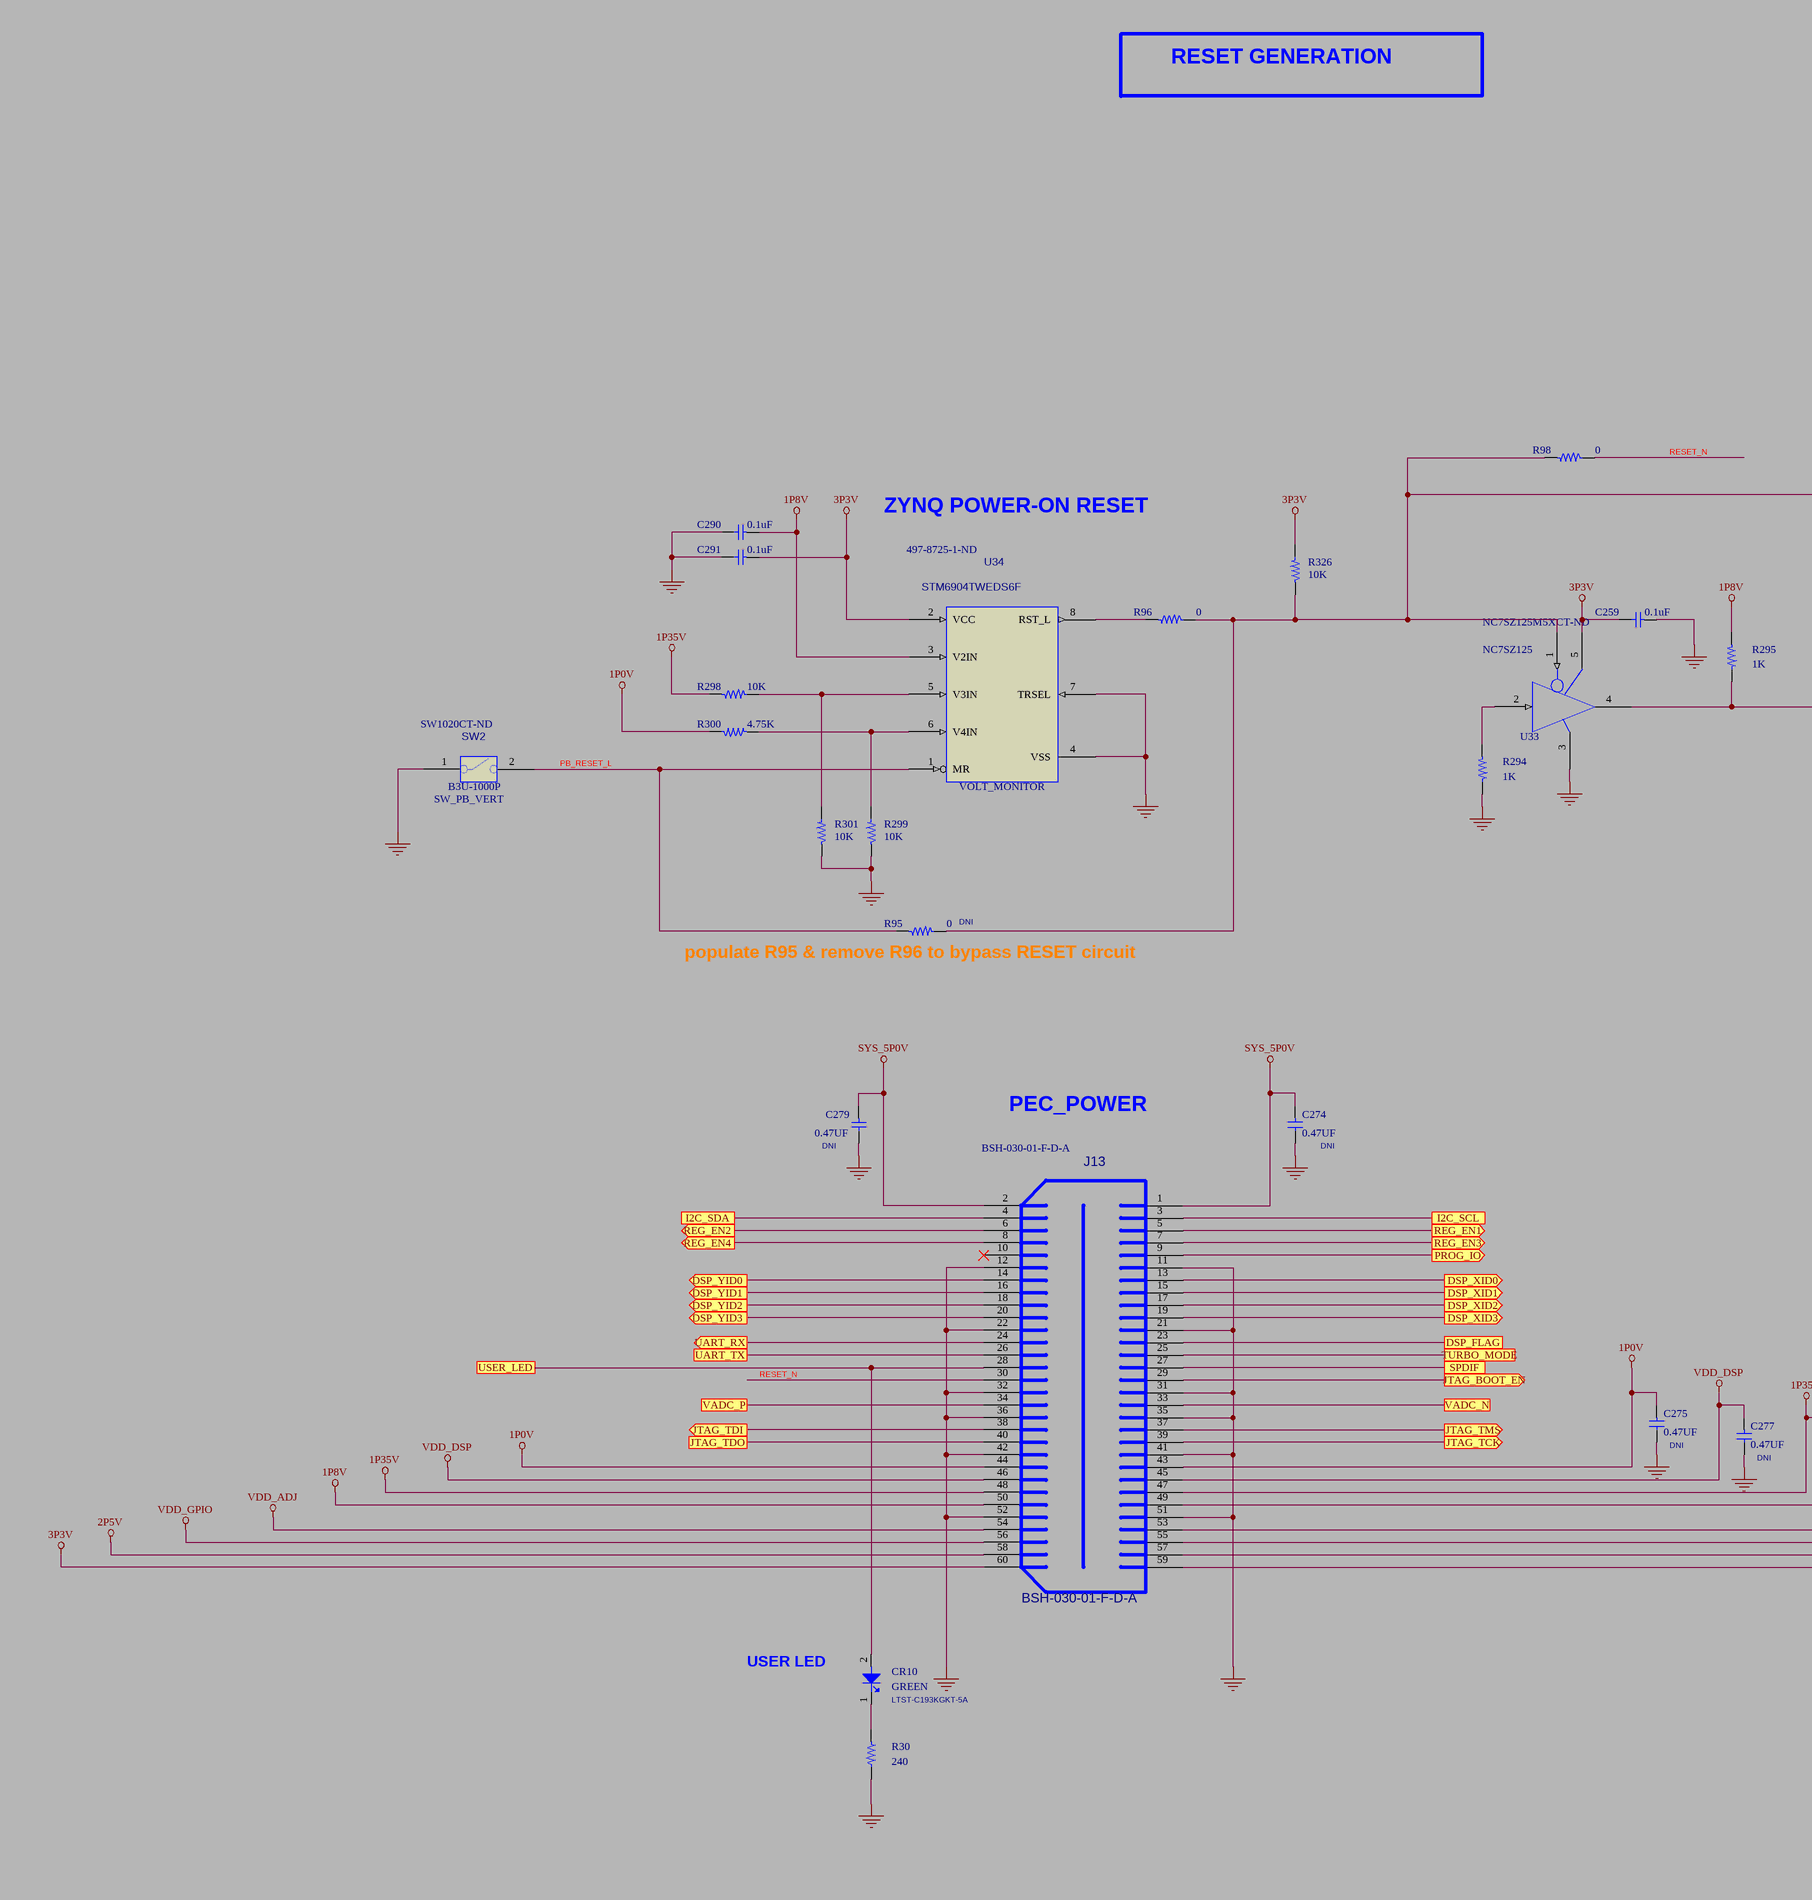
[diagram p23: 17-RESET GENERATION.SchDoc, left]
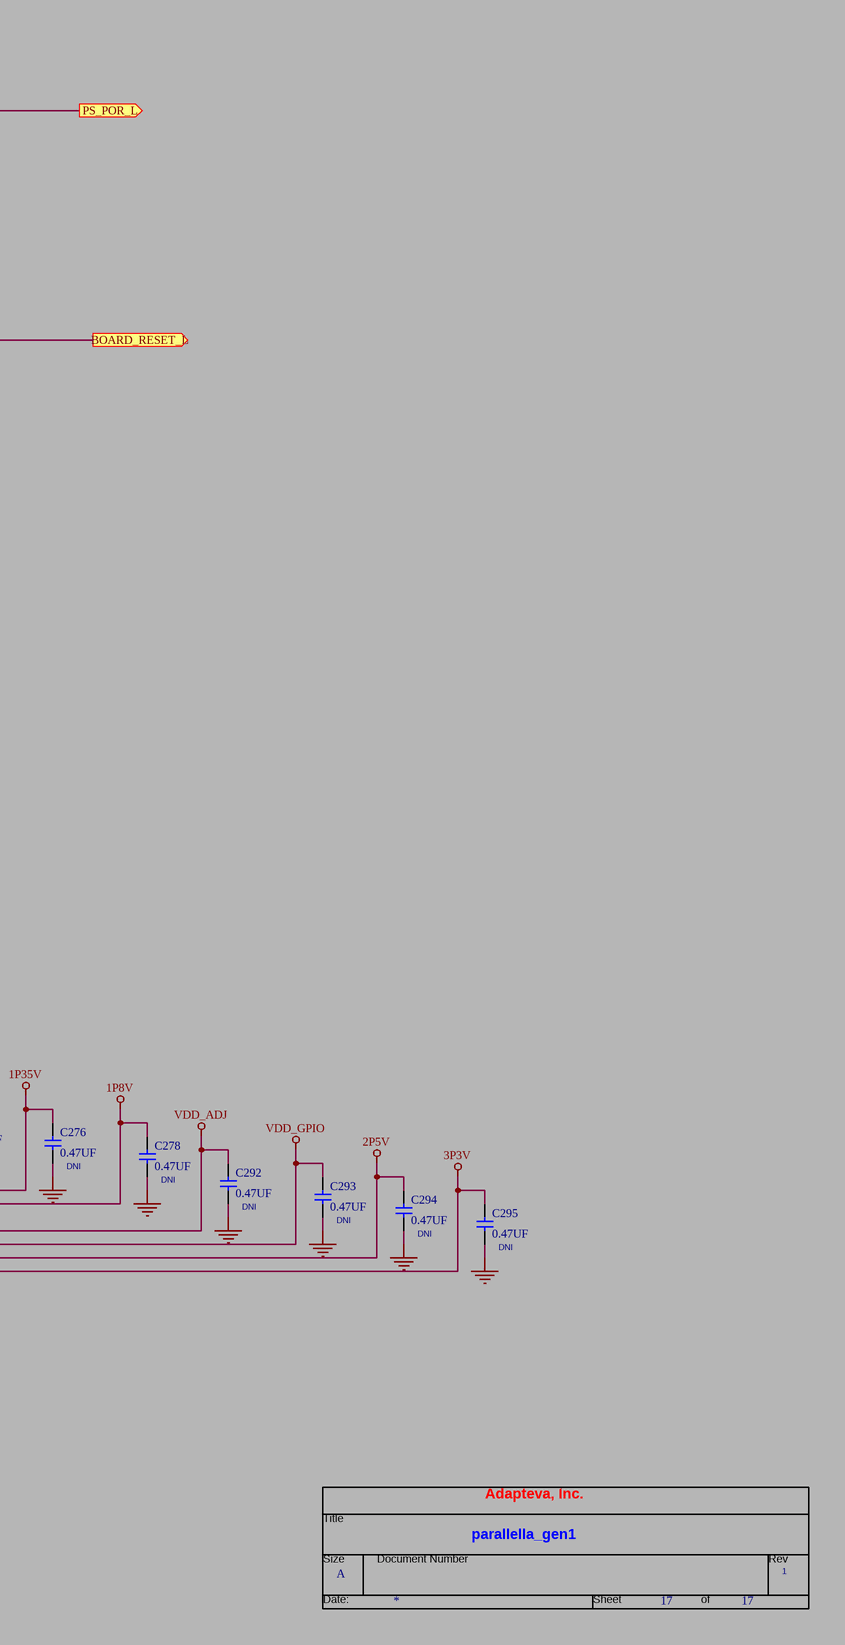
[diagram p24: 17-RESET GENERATION.SchDoc, right]

### Parts
(Parts that share a designator on the sheet are numbered #1, #2 ... from top to bottom, then left to right.)
*#17  RevCode: 1  Title: parallella_gen1  Page Size: A  Page Number: 17  OrgAddr1: Adapteva, Inc.  (hidden comment: TitleBlock0)  (graphical)
C259  0.1uF  [C0402]
C274  0.47UF  INSTALL: DNI  [C0402]
C275  0.47UF  INSTALL: DNI  [C0402]
C276  0.47UF  INSTALL: DNI  [C0402]
C277  0.47UF  INSTALL: DNI  [C0402]
C278  0.47UF  INSTALL: DNI  [C0402]
C279  0.47UF  INSTALL: DNI  [C0402]
C290  0.1uF  [C0402]
C291  0.1uF  [C0402]
C292  0.47UF  INSTALL: DNI  [C0402]
C293  0.47UF  INSTALL: DNI  [C0402]
C294  0.47UF  INSTALL: DNI  [C0402]
C295  0.47UF  INSTALL: DNI  [C0402]
CR10  GREEN  Vendor PN: LTST-C193KGKT-5A  [LED_0603]
J13  BSH-030-01-F-D-A  [CONN_BSH60P_13P59X25P88_P5P_V]
R30  240  [R0402]
R95  0  INSTALL: DNI  [R0402]
R96  0  [R0402]
R98  0  [R0402]
R294  1K  [R0402]
R295  1K  [R0402]
R298  10K  [R0402]
R299  10K  [R0402]
R300  4.75K  [R0402]
R301  10K  [R0402]
R326  10K  [R0402]
SW2  SW_PB_VERT  Vendor PN: B3U-1000P  Supplier Part Number 1: SW1020CT-ND  [SWITCH_2P5X4X1P6MMH]
U33  NC7SZ125  Supplier Part Number 1: NC7SZ125M5XCT-ND  [SOT_5PIN]
U34  VOLT_MONITOR  MFG PART NO: STM6904TWEDS6F  Supplier Part Number 1: 497-8725-1-ND  [TSSOP8_3SQX1P1H_P65P]

### Ports
BOARD_RESET_L (out), DSP_FLAG, DSP_XID0 (out), DSP_XID1 (out), DSP_XID2 (out), DSP_XID3 (out), DSP_YID0 (out), DSP_YID1 (out), DSP_YID2 (out), DSP_YID3 (out), I2C_SCL, I2C_SDA, JTAG_BOOT_EN (out), JTAG_TCK (out), JTAG_TDI (out), JTAG_TDO, JTAG_TMS (out), PROG_IO (out), PS_POR_L (out), REG_EN1 (out), REG_EN2 (out), REG_EN3 (out), REG_EN4 (out), SPDIF, TURBO_MODE, UART_RX (out), UART_TX, USER_LED, VADC_N, VADC_P

### Nets
1P0V: C275.1 J13.43 J13.44 R300.2
1P8V: C278.1 C290.1 J13.49 J13.50 R295.1 U34.3(V2IN)
1P35V: C276.1 J13.47 J13.48 R298.1
2P5V: C294.1 J13.57 J13.58
3P3V: C259.2 C291.1 C295.1 J13.59 J13.60 R326.2 U33.5(VCC) U34.2(VCC)
GND: C259.1 C274.2 C275.2 C276.2 C277.2 C278.2 C279.2 C290.2 C291.2 C292.2 C293.2 C294.2 C295.2 J13.11 J13.12 J13.21 J13.22 J13.31 J13.32 J13.35 J13.36 J13.41 J13.42 J13.51 J13.52 R30.2 R294.2 R299.1 R301.1 SW2.1(A) U33.3(GND) U34.4(VSS) U34.7(TRSEL)  [project net PHY_DIS_REG10]
SYS_5P0V: C274.1 C279.1 J13.1 J13.2
VDD_ADJ: C292.1 J13.53 J13.54
VDD_DSP: C277.1 J13.45 J13.46
VDD_GPIO: C293.1 J13.55 J13.56
PB_RESET_L: R95.1 SW2.2(B) U34.1(MR)
RESET_N: J13.30 R98.2
UART_RX: J13.24 ; port UART_RX
UART_TX: J13.26 ; port UART_TX
NetCR10_1: CR10.1(C) R30.1
NetCR10_2: CR10.2(A) J13.28 ; port USER_LED
NetJ13_3: J13.3 ; port I2C_SCL
NetJ13_4: J13.4 ; port I2C_SDA
NetJ13_5: J13.5 ; port REG_EN1
NetJ13_6: J13.6 ; port REG_EN2
NetJ13_7: J13.7 ; port REG_EN3
NetJ13_8: J13.8 ; port REG_EN4
NetJ13_9: J13.9 ; port PROG_IO
NetJ13_13: J13.13 ; port DSP_XID0
NetJ13_14: J13.14 ; port DSP_YID0
NetJ13_15: J13.15 ; port DSP_XID1
NetJ13_16: J13.16 ; port DSP_YID1
NetJ13_17: J13.17 ; port DSP_XID2
NetJ13_18: J13.18 ; port DSP_YID2
NetJ13_19: J13.19 ; port DSP_XID3
NetJ13_20: J13.20 ; port DSP_YID3
NetJ13_23: J13.23 ; port DSP_FLAG
NetJ13_25: J13.25 ; port TURBO_MODE
NetJ13_27: J13.27 ; port SPDIF
NetJ13_29: J13.29 ; port JTAG_BOOT_EN
NetJ13_33: J13.33 ; port VADC_N
NetJ13_34: J13.34 ; port VADC_P
NetJ13_37: J13.37 ; port JTAG_TMS
NetJ13_38: J13.38 ; port JTAG_TDI
NetJ13_39: J13.39 ; port JTAG_TCK
NetJ13_40: J13.40 ; port JTAG_TDO
NetR95_2: R95.2 R96.2 R98.1 R326.1 U33.1(~{OE}) ; port PS_POR_L
NetR96_1: R96.1 U34.8(RST_L)
NetR294_1: R294.1 U33.2(A)
NetR295_2: R295.2 U33.4(Y) ; port BOARD_RESET_L
NetR298_2: R298.2 R301.2 U34.5(V3IN)
NetR299_2: R299.2 R300.1 U34.6(V4IN)

Not connected (* = marked no-connect by the designer): J13 10*

### Notes on the sheet
- RESET GENERATION
- ZYNQ POWER-ON RESET
- (near R95) populate R95 & remove R96 to bypass RESET circuit
- PEC_POWER
- USER LED
- (in symbol TitleBlock0) Title; Size; Document Number; Rev; Date:; Sheet; of

### Library data of the parts
C259 C290 C291 = CAP0402_0P1UF_X5R_35V: as C288 on sheet 16-POWER MANAGEMENT; DEVICE: CAP0402_0P1UF_X5R_35V; MFG PART NO: GMK105BJ104KV-F; MFG: TAIYO YUDEN; PCB Footprint: C0402
C274-C279 C292-C295 = CAP0402_0P47UF_X5R: CAP, 0402, 0.47UF, X5R, 16V; MFG PART NO: C1005X5R1C474K; MFG: TDK; ALT_SYMBOLS: C0402_BGA; DEVICE: CAP0402_0P47UF_X5R; Vendor: TDK; Vendor PN: C1005X5R1C474K; PCB Footprint: C0402
CR10 = LED_0603_5MA_GRN: as CR8 on sheet 16-POWER MANAGEMENT; MFG PART NO: LTST-C193KGKT-5A; Vendor: LITE-ON INC; PCB Footprint: LED_0603
J13 = CON_BSH_030_VERT: Vendor: SAMTEC; Vendor PN: BSH-030-01-F-D-A; DEVICE: CON_BSH_030_VERT; PCB Footprint: CONN_BSH60P_13P59X25P88_P5P_V; Supplier 1: Arrow; Supplier Part Number 1: BSH-030-01-F-D-A
R30 = RES0402_240: RES, 0402, 240, 1%; MFG PART NO: CRCW0402240RFKED; ALT_SYMBOLS: R0402_BGA; MFG: VISHAY; Vendor: VISHAY/DALE; DEVICE: RES0402_240; Vendor PN: CRCW0402240RFKED; PCB Footprint: R0402
R95 R96 R98 = RES0402_0: as R286 on sheet 16-POWER MANAGEMENT; DEVICE: RES0402_0; Vendor PN: CRCW04020000Z0ED; PCB Footprint: R0402
R294 R295 = RES0402_1K: as R327 on sheet 16-POWER MANAGEMENT; DEVICE: RES0402_1K; Vendor PN: CRCW04021K00FKED; PCB Footprint: R0402
R298 R299 R301 R326 = RES0402_10K: as R273 on sheet 16-POWER MANAGEMENT; DEVICE: RES0402_10K; Vendor PN: CRCW040210K0FKED; PCB Footprint: R0402
R300 = RES0402_4K75: RES, 0402, 4.75K, 1%; MFG PART NO: CRCW04024K75FKED; MFG: VISHAY; Vendor: VISHAY/DALE; ALT_SYMBOLS: R0402_BGA; DEVICE: RES0402_4K75; Vendor PN: CRCW04024K75FKED; PCB Footprint: R0402
SW2 = SW_PB_SPST_2PIN: SW, PUSHBUTTON, SPST, NORMALLY OPEN, SMT; Vendor: OMRON; DEVICE: SW_PB_SPST_2PIN; PCB Footprint: SWITCH_2P5X4X1P6MMH; Supplier 1: Digi-Key
U33 = NC7SZ125: as U36 on sheet 16-POWER MANAGEMENT; VENDOR_PN: NC7SZ125M5X; DEVICE: NC7SZ125; MFG: FAIRCHILD; MFG PART NO: NC7SZ125M5X; PCB Footprint: SOT_5PIN; Supplier 1: Digi-Key
U34 = VOLTMON_4IN_3P3: IC,  SUPPLY MONITOR, 4 INPUTS, TSSOP8; MFG: ST MICROELECTRONICS; DEVICE: VOLTMON_4IN_3P3; Vendor: ST MICROELECTRONICS; Vendor PN: STM6904TWEDS6F; PCB Footprint: TSSOP8_3SQX1P1H_P65P; Supplier 1: Digi-Key
*#17 = TitleBlock0: Page Create Date: March  8, 1995; Page Count: 17; Page Modify Date: *

## Nets that join several sheets
1P0V: 05-GIGE PORT (FB4.1), 10-ZYNQ PWR & GND (47 pins), 16-POWER MANAGEMENT (R286.2 TP13.1), 17-RESET GENERATION (C275.1 J13.43 J13.44 R300.2)
1P8V: 02-ZYNQ BANK 0 (5 pins), 04-ZYNQ BANK 501 (13 pins), 05-GIGE PORT (FB3.2 FB5.2 FB6.1 FB7.2), 06-USB PORTS (18 pins), 10-ZYNQ PWR & GND (18 pins), 11-DSP PROCESSOR 1-OF-3 (11 pins), 12-DSP PROCESSOR 2-OF-3 (6 pins), 13-DSP PROCESSOR 3-OF-3 (34 pins), 14-DSP eLINK CONNECTORS (8 pins), 15-HDMI TRNSMITTER (FB14.1 FB15.1 FB17.1 FB18.1), 16-POWER MANAGEMENT (R287.2), 17-RESET GENERATION (6 pins)
1P35V: 07-ZYNQ BANK 502 (24 pins), 08-DDR3-256MX32 (28 pins), 16-POWER MANAGEMENT (R331.2), 17-RESET GENERATION (C276.1 J13.47 J13.48 R298.1)
2P5V: 09-PL BANKS 34 & 35 (15 pins), 11-DSP PROCESSOR 1-OF-3 (C297.2 C298.1 U38.5 U38.10), 16-POWER MANAGEMENT (R329.2), 17-RESET GENERATION (C294.1 J13.57 J13.58)
3P3V: 02-ZYNQ BANK 0 (16 pins), 03-ZYNQ BANK 500 (24 pins), 05-GIGE PORT (J5.14 J5.16), 06-USB PORTS (R89.1), 15-HDMI TRNSMITTER (FB16.2 R225.1), 16-POWER MANAGEMENT (C288.2 R293.2 U36.5), 17-RESET GENERATION (8 pins)
P1_VBUS: 06-USB PORTS (6 pins), 16-POWER MANAGEMENT (C287.1 J14.3)
PHY_DIS_REG10: 02-ZYNQ BANK 0 (19 pins), 03-ZYNQ BANK 500 (26 pins), 04-ZYNQ BANK 501 (8 pins), 05-GIGE PORT (32 pins), 06-USB PORTS (22 pins), 07-ZYNQ BANK 502 (17 pins), 08-DDR3-256MX32 (52 pins), 09-PL BANKS 34 & 35 (20 pins), 10-ZYNQ PWR & GND (110 pins), 11-DSP PROCESSOR 1-OF-3 (13 pins), 12-DSP PROCESSOR 2-OF-3 (6 pins), 13-DSP PROCESSOR 3-OF-3 (98 pins), 14-DSP eLINK CONNECTORS (24 pins), 15-HDMI TRNSMITTER (57 pins), 16-POWER MANAGEMENT (39 pins), 17-RESET GENERATION (33 pins)
SYS_5P0V: 06-USB PORTS (C52.1 C59.1 U12.21 U13.7), 15-HDMI TRNSMITTER (C258.1 U37.11), 16-POWER MANAGEMENT (20 pins), 17-RESET GENERATION (C274.1 C279.1 J13.1 J13.2)
VDD_ADJ: 16-POWER MANAGEMENT (R332.2), 17-RESET GENERATION (C292.1 J13.53 J13.54)
VDD_DSP: 13-DSP PROCESSOR 3-OF-3 (32 pins), 16-POWER MANAGEMENT (C218.1 R330.2), 17-RESET GENERATION (C277.1 J13.45 J13.46)
VDD_GPIO: 09-PL BANKS 34 & 35 (17 pins), 10-ZYNQ PWR & GND (13 pins), 15-HDMI TRNSMITTER (9 pins), 16-POWER MANAGEMENT (R328.1 R333.2), 17-RESET GENERATION (C293.1 J13.55 J13.56)
DSP_RESET_L: 09-PL BANKS 34 & 35 (R178.2 U2.G14), 11-DSP PROCESSOR 1-OF-3 (U23.F11)
NetCR10_2: 03-ZYNQ BANK 500 (R334.2), 17-RESET GENERATION (CR10.2 J13.28)
NetJ8_3: 12-DSP PROCESSOR 2-OF-3 (R194.2 U23.A2), 14-DSP eLINK CONNECTORS (J8.3)
NetJ8_4: 12-DSP PROCESSOR 2-OF-3 (R195.2 U23.B3), 14-DSP eLINK CONNECTORS (J8.4)
NetJ8_5: 12-DSP PROCESSOR 2-OF-3 (R194.1 U23.A3), 14-DSP eLINK CONNECTORS (J8.5)
NetJ8_6: 12-DSP PROCESSOR 2-OF-3 (R195.1 U23.B4), 14-DSP eLINK CONNECTORS (J8.6)
NetJ8_7: 12-DSP PROCESSOR 2-OF-3 (R196.2 U23.C4), 14-DSP eLINK CONNECTORS (J8.7)
NetJ8_8: 12-DSP PROCESSOR 2-OF-3 (R197.2 U23.D5), 14-DSP eLINK CONNECTORS (J8.8)
NetJ8_9: 12-DSP PROCESSOR 2-OF-3 (R196.1 U23.C5), 14-DSP eLINK CONNECTORS (J8.9)
NetJ8_10: 12-DSP PROCESSOR 2-OF-3 (R197.1 U23.D6), 14-DSP eLINK CONNECTORS (J8.10)
NetJ8_13: 12-DSP PROCESSOR 2-OF-3 (R198.2 U23.A4), 14-DSP eLINK CONNECTORS (J8.13)
NetJ8_14: 12-DSP PROCESSOR 2-OF-3 (R199.2 U23.B5), 14-DSP eLINK CONNECTORS (J8.14)
NetJ8_15: 12-DSP PROCESSOR 2-OF-3 (R198.1 U23.A5), 14-DSP eLINK CONNECTORS (J8.15)
NetJ8_16: 12-DSP PROCESSOR 2-OF-3 (R199.1 U23.B6), 14-DSP eLINK CONNECTORS (J8.16)
NetJ8_17: 12-DSP PROCESSOR 2-OF-3 (R200.2 U23.C6), 14-DSP eLINK CONNECTORS (J8.17)
NetJ8_18: 12-DSP PROCESSOR 2-OF-3 (R201.2 U23.D7), 14-DSP eLINK CONNECTORS (J8.18)
NetJ8_19: 12-DSP PROCESSOR 2-OF-3 (R200.1 U23.C7), 14-DSP eLINK CONNECTORS (J8.19)
NetJ8_20: 12-DSP PROCESSOR 2-OF-3 (R201.1 U23.D8), 14-DSP eLINK CONNECTORS (J8.20)
NetJ8_23: 12-DSP PROCESSOR 2-OF-3 (R203.2 U23.A6), 14-DSP eLINK CONNECTORS (J8.23)
NetJ8_24: 12-DSP PROCESSOR 2-OF-3 (R202.2 R242.2 U23.B7), 14-DSP eLINK CONNECTORS (J8.24)
NetJ8_25: 12-DSP PROCESSOR 2-OF-3 (R203.1 U23.A7), 14-DSP eLINK CONNECTORS (J8.25)
NetJ8_26: 12-DSP PROCESSOR 2-OF-3 (R202.1 R243.2 U23.B8), 14-DSP eLINK CONNECTORS (J8.26)
NetJ8_27: 12-DSP PROCESSOR 2-OF-3 (U23.B9), 14-DSP eLINK CONNECTORS (J8.27)
NetJ8_28: 12-DSP PROCESSOR 2-OF-3 (U23.C8), 14-DSP eLINK CONNECTORS (J8.28)
NetJ8_29: 12-DSP PROCESSOR 2-OF-3 (U23.B10), 14-DSP eLINK CONNECTORS (J8.29)
NetJ8_30: 12-DSP PROCESSOR 2-OF-3 (U23.C9), 14-DSP eLINK CONNECTORS (J8.30)
NetJ8_33: 12-DSP PROCESSOR 2-OF-3 (U23.D9), 14-DSP eLINK CONNECTORS (J8.33)
NetJ8_34: 12-DSP PROCESSOR 2-OF-3 (R205.2 U23.C10), 14-DSP eLINK CONNECTORS (J8.34)
NetJ8_35: 12-DSP PROCESSOR 2-OF-3 (U23.D10), 14-DSP eLINK CONNECTORS (J8.35)
NetJ8_36: 12-DSP PROCESSOR 2-OF-3 (R205.1 U23.C11), 14-DSP eLINK CONNECTORS (J8.36)
NetJ8_37: 12-DSP PROCESSOR 2-OF-3 (R206.2 U23.A12), 14-DSP eLINK CONNECTORS (J8.37)
NetJ8_38: 12-DSP PROCESSOR 2-OF-3 (R204.2 R240.1 U23.B11), 14-DSP eLINK CONNECTORS (J8.38)
NetJ8_39: 12-DSP PROCESSOR 2-OF-3 (R206.1 U23.A13), 14-DSP eLINK CONNECTORS (J8.39)
NetJ8_40: 12-DSP PROCESSOR 2-OF-3 (R204.1 R241.1 U23.B12), 14-DSP eLINK CONNECTORS (J8.40)
NetJ8_43: 12-DSP PROCESSOR 2-OF-3 (R233.2 U23.D11), 14-DSP eLINK CONNECTORS (J8.43)
NetJ8_44: 12-DSP PROCESSOR 2-OF-3 (R232.2 U23.C12), 14-DSP eLINK CONNECTORS (J8.44)
NetJ8_45: 12-DSP PROCESSOR 2-OF-3 (R233.1 U23.D12), 14-DSP eLINK CONNECTORS (J8.45)
NetJ8_46: 12-DSP PROCESSOR 2-OF-3 (R232.1 U23.C13), 14-DSP eLINK CONNECTORS (J8.46)
NetJ8_47: 12-DSP PROCESSOR 2-OF-3 (R231.2 U23.B13), 14-DSP eLINK CONNECTORS (J8.47)
NetJ8_48: 12-DSP PROCESSOR 2-OF-3 (R230.2 U23.A14), 14-DSP eLINK CONNECTORS (J8.48)
NetJ8_49: 12-DSP PROCESSOR 2-OF-3 (R231.1 U23.B14), 14-DSP eLINK CONNECTORS (J8.49)
NetJ8_50: 12-DSP PROCESSOR 2-OF-3 (R230.1 U23.A15), 14-DSP eLINK CONNECTORS (J8.50)
NetJ8_53: 12-DSP PROCESSOR 2-OF-3 (R229.2 U23.D13), 14-DSP eLINK CONNECTORS (J8.53)
NetJ8_54: 12-DSP PROCESSOR 2-OF-3 (R228.2 U23.C14), 14-DSP eLINK CONNECTORS (J8.54)
NetJ8_55: 12-DSP PROCESSOR 2-OF-3 (R229.1 U23.D14), 14-DSP eLINK CONNECTORS (J8.55)
NetJ8_56: 12-DSP PROCESSOR 2-OF-3 (R228.1 U23.C15), 14-DSP eLINK CONNECTORS (J8.56)
NetJ8_57: 12-DSP PROCESSOR 2-OF-3 (R227.2 U23.B15), 14-DSP eLINK CONNECTORS (J8.57)
NetJ8_58: 12-DSP PROCESSOR 2-OF-3 (R226.2 U23.A16), 14-DSP eLINK CONNECTORS (J8.58)
NetJ8_59: 12-DSP PROCESSOR 2-OF-3 (R227.1 U23.B16), 14-DSP eLINK CONNECTORS (J8.59)
NetJ8_60: 12-DSP PROCESSOR 2-OF-3 (R226.1 U23.A17), 14-DSP eLINK CONNECTORS (J8.60)
NetJ9_3: 12-DSP PROCESSOR 2-OF-3 (R207.2 U23.V3), 14-DSP eLINK CONNECTORS (J9.3)
NetJ9_4: 12-DSP PROCESSOR 2-OF-3 (R208.2 U23.U4), 14-DSP eLINK CONNECTORS (J9.4)
NetJ9_5: 12-DSP PROCESSOR 2-OF-3 (R207.1 U23.V2), 14-DSP eLINK CONNECTORS (J9.5)
NetJ9_6: 12-DSP PROCESSOR 2-OF-3 (R208.1 U23.U3), 14-DSP eLINK CONNECTORS (J9.6)
NetJ9_7: 12-DSP PROCESSOR 2-OF-3 (R209.2 U23.T5), 14-DSP eLINK CONNECTORS (J9.7)
NetJ9_8: 12-DSP PROCESSOR 2-OF-3 (R210.2 U23.R6), 14-DSP eLINK CONNECTORS (J9.8)
NetJ9_9: 12-DSP PROCESSOR 2-OF-3 (R209.1 U23.T4), 14-DSP eLINK CONNECTORS (J9.9)
NetJ9_10: 12-DSP PROCESSOR 2-OF-3 (R210.1 U23.R5), 14-DSP eLINK CONNECTORS (J9.10)
NetJ9_13: 12-DSP PROCESSOR 2-OF-3 (R211.2 U23.V5), 14-DSP eLINK CONNECTORS (J9.13)
NetJ9_14: 12-DSP PROCESSOR 2-OF-3 (R212.2 U23.U6), 14-DSP eLINK CONNECTORS (J9.14)
NetJ9_15: 12-DSP PROCESSOR 2-OF-3 (R211.1 U23.V4), 14-DSP eLINK CONNECTORS (J9.15)
NetJ9_16: 12-DSP PROCESSOR 2-OF-3 (R212.1 U23.U5), 14-DSP eLINK CONNECTORS (J9.16)
NetJ9_17: 12-DSP PROCESSOR 2-OF-3 (R213.2 U23.T7), 14-DSP eLINK CONNECTORS (J9.17)
NetJ9_18: 12-DSP PROCESSOR 2-OF-3 (R214.2 U23.R8), 14-DSP eLINK CONNECTORS (J9.18)
NetJ9_19: 12-DSP PROCESSOR 2-OF-3 (R213.1 U23.T6), 14-DSP eLINK CONNECTORS (J9.19)
NetJ9_20: 12-DSP PROCESSOR 2-OF-3 (R214.1 U23.R7), 14-DSP eLINK CONNECTORS (J9.20)
NetJ9_23: 12-DSP PROCESSOR 2-OF-3 (R216.2 U23.V7), 14-DSP eLINK CONNECTORS (J9.23)
NetJ9_24: 12-DSP PROCESSOR 2-OF-3 (R215.2 R247.2 U23.U8), 14-DSP eLINK CONNECTORS (J9.24)
NetJ9_25: 12-DSP PROCESSOR 2-OF-3 (R216.1 U23.V6), 14-DSP eLINK CONNECTORS (J9.25)
NetJ9_26: 12-DSP PROCESSOR 2-OF-3 (R215.1 R246.2 U23.U7), 14-DSP eLINK CONNECTORS (J9.26)
NetJ9_27: 12-DSP PROCESSOR 2-OF-3 (R234.2 U23.U10), 14-DSP eLINK CONNECTORS (J9.27)
NetJ9_28: 12-DSP PROCESSOR 2-OF-3 (R235.2 U23.T9), 14-DSP eLINK CONNECTORS (J9.28)
NetJ9_29: 12-DSP PROCESSOR 2-OF-3 (R234.1 U23.U9), 14-DSP eLINK CONNECTORS (J9.29)
NetJ9_30: 12-DSP PROCESSOR 2-OF-3 (R235.1 U23.T8), 14-DSP eLINK CONNECTORS (J9.30)
NetJ9_33: 12-DSP PROCESSOR 2-OF-3 (R236.2 R244.1 U23.R10), 14-DSP eLINK CONNECTORS (J9.33)
NetJ9_34: 12-DSP PROCESSOR 2-OF-3 (R218.2 U23.T11), 14-DSP eLINK CONNECTORS (J9.34)
NetJ9_35: 12-DSP PROCESSOR 2-OF-3 (R236.1 R245.1 U23.R9), 14-DSP eLINK CONNECTORS (J9.35)
NetJ9_36: 12-DSP PROCESSOR 2-OF-3 (R218.1 U23.T10), 14-DSP eLINK CONNECTORS (J9.36)
NetJ9_37: 12-DSP PROCESSOR 2-OF-3 (U23.V13), 14-DSP eLINK CONNECTORS (J9.37)
NetJ9_38: 12-DSP PROCESSOR 2-OF-3 (R217.2 U23.U12), 14-DSP eLINK CONNECTORS (J9.38)
NetJ9_39: 12-DSP PROCESSOR 2-OF-3 (U23.V12), 14-DSP eLINK CONNECTORS (J9.39)
NetJ9_40: 12-DSP PROCESSOR 2-OF-3 (R217.1 U23.U11), 14-DSP eLINK CONNECTORS (J9.40)
NetJ9_43: 12-DSP PROCESSOR 2-OF-3 (U23.R12), 14-DSP eLINK CONNECTORS (J9.43)
NetJ9_44: 12-DSP PROCESSOR 2-OF-3 (U23.T13), 14-DSP eLINK CONNECTORS (J9.44)
NetJ9_45: 12-DSP PROCESSOR 2-OF-3 (U23.R11), 14-DSP eLINK CONNECTORS (J9.45)
NetJ9_46: 12-DSP PROCESSOR 2-OF-3 (U23.T12), 14-DSP eLINK CONNECTORS (J9.46)
NetJ9_47: 12-DSP PROCESSOR 2-OF-3 (U23.U14), 14-DSP eLINK CONNECTORS (J9.47)
NetJ9_48: 12-DSP PROCESSOR 2-OF-3 (U23.V15), 14-DSP eLINK CONNECTORS (J9.48)
NetJ9_49: 12-DSP PROCESSOR 2-OF-3 (U23.U13), 14-DSP eLINK CONNECTORS (J9.49)
NetJ9_50: 12-DSP PROCESSOR 2-OF-3 (U23.V14), 14-DSP eLINK CONNECTORS (J9.50)
NetJ9_53: 12-DSP PROCESSOR 2-OF-3 (U23.R14), 14-DSP eLINK CONNECTORS (J9.53)
NetJ9_54: 12-DSP PROCESSOR 2-OF-3 (U23.T15), 14-DSP eLINK CONNECTORS (J9.54)
NetJ9_55: 12-DSP PROCESSOR 2-OF-3 (U23.R13), 14-DSP eLINK CONNECTORS (J9.55)
NetJ9_56: 12-DSP PROCESSOR 2-OF-3 (U23.T14), 14-DSP eLINK CONNECTORS (J9.56)
NetJ9_57: 12-DSP PROCESSOR 2-OF-3 (U23.U16), 14-DSP eLINK CONNECTORS (J9.57)
NetJ9_58: 12-DSP PROCESSOR 2-OF-3 (U23.V17), 14-DSP eLINK CONNECTORS (J9.58)
NetJ9_59: 12-DSP PROCESSOR 2-OF-3 (U23.U15), 14-DSP eLINK CONNECTORS (J9.59)
NetJ9_60: 12-DSP PROCESSOR 2-OF-3 (U23.V16), 14-DSP eLINK CONNECTORS (J9.60)
NetJ11_3: 09-PL BANKS 34 & 35 (U2.U17), 15-HDMI TRNSMITTER (J11.3)
NetJ11_4: 09-PL BANKS 34 & 35 (U2.W16), 15-HDMI TRNSMITTER (J11.4)
NetJ11_5: 09-PL BANKS 34 & 35 (U2.T16), 15-HDMI TRNSMITTER (J11.5)
NetJ11_6: 09-PL BANKS 34 & 35 (U2.V16), 15-HDMI TRNSMITTER (J11.6)
NetJ11_7: 09-PL BANKS 34 & 35 (U2.P16), 15-HDMI TRNSMITTER (J11.7)
NetJ11_8: 09-PL BANKS 34 & 35 (U2.U19), 15-HDMI TRNSMITTER (J11.8)
NetJ11_9: 09-PL BANKS 34 & 35 (U2.P15), 15-HDMI TRNSMITTER (J11.9)
NetJ11_10: 09-PL BANKS 34 & 35 (U2.U18), 15-HDMI TRNSMITTER (J11.10)
NetJ11_13: 09-PL BANKS 34 & 35 (U2.R14), 15-HDMI TRNSMITTER (J11.13)
NetJ11_14: 09-PL BANKS 34 & 35 (U2.T15), 15-HDMI TRNSMITTER (J11.14)
NetJ11_15: 09-PL BANKS 34 & 35 (U2.P14), 15-HDMI TRNSMITTER (J11.15)
NetJ11_16: 09-PL BANKS 34 & 35 (U2.T14), 15-HDMI TRNSMITTER (J11.16)
NetJ11_17: 09-PL BANKS 34 & 35 (U2.U15), 15-HDMI TRNSMITTER (J11.17)
NetJ11_18: 09-PL BANKS 34 & 35 (U2.Y14), 15-HDMI TRNSMITTER (J11.18)
NetJ11_19: 09-PL BANKS 34 & 35 (U2.U14), 15-HDMI TRNSMITTER (J11.19)
NetJ11_20: 09-PL BANKS 34 & 35 (U2.W14), 15-HDMI TRNSMITTER (J11.20)
NetJ11_23: 09-PL BANKS 34 & 35 (U2.V13), 15-HDMI TRNSMITTER (J11.23)
NetJ11_24: 09-PL BANKS 34 & 35 (U2.W13), 15-HDMI TRNSMITTER (J11.24)
NetJ11_25: 09-PL BANKS 34 & 35 (R223.2 U2.U13), 15-HDMI TRNSMITTER (J11.25)
NetJ11_26: 09-PL BANKS 34 & 35 (U2.V12), 15-HDMI TRNSMITTER (J11.26)
NetJ11_27: 09-PL BANKS 34 & 35 (U2.U12), 15-HDMI TRNSMITTER (J11.27)
NetJ11_28: 09-PL BANKS 34 & 35 (U2.T10), 15-HDMI TRNSMITTER (J11.28)
NetJ11_29: 09-PL BANKS 34 & 35 (U2.T12), 15-HDMI TRNSMITTER (J11.29)
NetJ11_30: 09-PL BANKS 34 & 35 (U2.T11), 15-HDMI TRNSMITTER (J11.30)
NetJ11_33: 10-ZYNQ PWR & GND (U2.Y13), 15-HDMI TRNSMITTER (J11.33)
NetJ11_34: 10-ZYNQ PWR & GND (U2.Y11), 15-HDMI TRNSMITTER (J11.34)
NetJ11_35: 10-ZYNQ PWR & GND (U2.Y12), 15-HDMI TRNSMITTER (J11.35)
NetJ11_36: 10-ZYNQ PWR & GND (U2.W11), 15-HDMI TRNSMITTER (J11.36)
NetJ11_37: 10-ZYNQ PWR & GND (U2.V10), 15-HDMI TRNSMITTER (J11.37)
NetJ11_38: 10-ZYNQ PWR & GND (U2.U10), 15-HDMI TRNSMITTER (J11.38)
NetJ11_39: 10-ZYNQ PWR & GND (U2.V11), 15-HDMI TRNSMITTER (J11.39)
NetJ11_40: 10-ZYNQ PWR & GND (U2.T9), 15-HDMI TRNSMITTER (J11.40)
NetJ11_43: 10-ZYNQ PWR & GND (U2.W9), 15-HDMI TRNSMITTER (J11.43)
NetJ11_44: 10-ZYNQ PWR & GND (U2.U8), 15-HDMI TRNSMITTER (J11.44)
NetJ11_45: 10-ZYNQ PWR & GND (U2.W10), 15-HDMI TRNSMITTER (J11.45)
NetJ11_46: 10-ZYNQ PWR & GND (U2.U9), 15-HDMI TRNSMITTER (J11.46)
NetJ11_47: 10-ZYNQ PWR & GND (U2.W8), 15-HDMI TRNSMITTER (J11.47)
NetJ11_48: 10-ZYNQ PWR & GND (U2.Y8), 15-HDMI TRNSMITTER (J11.48)
NetJ11_49: 10-ZYNQ PWR & GND (U2.V8), 15-HDMI TRNSMITTER (J11.49)
NetJ11_50: 10-ZYNQ PWR & GND (U2.Y9), 15-HDMI TRNSMITTER (J11.50)
NetJ11_53: 10-ZYNQ PWR & GND (U2.Y6), 15-HDMI TRNSMITTER (J11.53)
NetJ11_54: 10-ZYNQ PWR & GND (U2.V7), 15-HDMI TRNSMITTER (J11.54)
NetJ11_55: 10-ZYNQ PWR & GND (U2.Y7), 15-HDMI TRNSMITTER (J11.55)
NetJ11_56: 10-ZYNQ PWR & GND (U2.U7), 15-HDMI TRNSMITTER (J11.56)
NetJ11_57: 10-ZYNQ PWR & GND (U2.W6), 15-HDMI TRNSMITTER (J11.57)
NetJ11_58: 10-ZYNQ PWR & GND (U2.U5), 15-HDMI TRNSMITTER (J11.58)
NetJ11_59: 10-ZYNQ PWR & GND (U2.V6), 15-HDMI TRNSMITTER (J11.59)
NetJ11_60: 10-ZYNQ PWR & GND (U2.T5), 15-HDMI TRNSMITTER (J11.60)
NetJ13_3: 15-HDMI TRNSMITTER (U37.8), 16-POWER MANAGEMENT (R284.2 U30.3), 17-RESET GENERATION (J13.3)
NetJ13_4: 15-HDMI TRNSMITTER (U37.9), 16-POWER MANAGEMENT (R285.2 U30.4), 17-RESET GENERATION (J13.4)
NetJ13_5: 16-POWER MANAGEMENT (R276.1 U29.3), 17-RESET GENERATION (J13.5)
NetJ13_6: 16-POWER MANAGEMENT (R277.1 U29.10), 17-RESET GENERATION (J13.6)
NetJ13_7: 16-POWER MANAGEMENT (R280.1 U29.4), 17-RESET GENERATION (J13.7)
NetJ13_8: 16-POWER MANAGEMENT (R283.1 U29.8), 17-RESET GENERATION (J13.8)
NetJ13_9: 09-PL BANKS 34 & 35 (U2.N20), 17-RESET GENERATION (J13.9)
NetJ13_13: 11-DSP PROCESSOR 1-OF-3 (R156.1 R160.1 U23.F12), 17-RESET GENERATION (J13.13)
NetJ13_14: 11-DSP PROCESSOR 1-OF-3 (R161.1 R168.1 U23.E10), 17-RESET GENERATION (J13.14)
NetJ13_15: 11-DSP PROCESSOR 1-OF-3 (R157.1 R165.1 U23.E8), 17-RESET GENERATION (J13.15)
NetJ13_16: 11-DSP PROCESSOR 1-OF-3 (R162.1 R169.1 U23.E11), 17-RESET GENERATION (J13.16)
NetJ13_17: 11-DSP PROCESSOR 1-OF-3 (R158.1 R166.1 U23.F10), 17-RESET GENERATION (J13.17)
NetJ13_18: 11-DSP PROCESSOR 1-OF-3 (R163.1 R170.1 U23.E9), 17-RESET GENERATION (J13.18)
NetJ13_19: 11-DSP PROCESSOR 1-OF-3 (R159.1 R167.1 U23.E7), 17-RESET GENERATION (J13.19)
NetJ13_20: 11-DSP PROCESSOR 1-OF-3 (R164.1 R171.1 U23.F9), 17-RESET GENERATION (J13.20)
NetJ13_23: 11-DSP PROCESSOR 1-OF-3 (R1.1 R179.1 U23.E12), 17-RESET GENERATION (J13.23)
NetJ13_25: 09-PL BANKS 34 & 35 (U2.R16), 16-POWER MANAGEMENT (R328.2 U36.4), 17-RESET GENERATION (J13.25)
NetJ13_27: 09-PL BANKS 34 & 35 (R82.2), 15-HDMI TRNSMITTER (U26.3), 17-RESET GENERATION (J13.27)
NetJ13_29: 03-ZYNQ BANK 500 (R97.2), 17-RESET GENERATION (J13.29)
NetJ13_33: 02-ZYNQ BANK 0 (R80.2 U2.L10), 17-RESET GENERATION (J13.33)
NetJ13_34: 02-ZYNQ BANK 0 (R81.2 U2.K9), 17-RESET GENERATION (J13.34)
NetJ13_37: 02-ZYNQ BANK 0 (R12.1 U2.J6), 17-RESET GENERATION (J13.37)
NetJ13_38: 02-ZYNQ BANK 0 (R9.1 U2.G6), 17-RESET GENERATION (J13.38)
NetJ13_39: 02-ZYNQ BANK 0 (R11.1 U2.F9), 17-RESET GENERATION (J13.39)
NetJ13_40: 02-ZYNQ BANK 0 (R10.1 U2.F6), 17-RESET GENERATION (J13.40)
NetR18_2: 09-PL BANKS 34 & 35 (R18.2 U2.N17), 15-HDMI TRNSMITTER (U37.3)
NetR20_2: 09-PL BANKS 34 & 35 (R20.2 U2.N18), 15-HDMI TRNSMITTER (U37.2)
NetR22_1: 09-PL BANKS 34 & 35 (U2.P20), 15-HDMI TRNSMITTER (R22.1 U26.28)
NetR41_2: 09-PL BANKS 34 & 35 (R41.2), 15-HDMI TRNSMITTER (U26.53)
NetR42_2: 09-PL BANKS 34 & 35 (R42.2), 15-HDMI TRNSMITTER (U26.2)
NetR44_2: 09-PL BANKS 34 & 35 (R44.2), 15-HDMI TRNSMITTER (U26.64)
NetR55_2: 02-ZYNQ BANK 0 (R55.2), 03-ZYNQ BANK 500 (U2.E7)
NetR59_2: 04-ZYNQ BANK 501 (R59.2), 05-GIGE PORT (U9.47)
NetR60_2: 04-ZYNQ BANK 501 (R60.2), 05-GIGE PORT (U9.4)
NetR61_1: 04-ZYNQ BANK 501 (R61.1 U2.C11), 05-GIGE PORT (U9.5)
NetR71_1: 04-ZYNQ BANK 501 (U2.B17), 05-GIGE PORT (R71.1)
NetR94_2: 09-PL BANKS 34 & 35 (R94.2), 15-HDMI TRNSMITTER (U26.63)
NetR95_2: 03-ZYNQ BANK 500 (U2.C7), 06-USB PORTS (R335.2), 17-RESET GENERATION (5 pins)
NetR99_2: 02-ZYNQ BANK 0 (R99.2), 06-USB PORTS (U12.26)
NetR110_2: 02-ZYNQ BANK 0 (R110.2), 06-USB PORTS (U17.26)
NetR111_1: 07-ZYNQ BANK 502 (R111.1 U2.B4), 08-DDR3-256MX32 (U20.H1)
NetR114_2: 02-ZYNQ BANK 0 (R114.2), 15-HDMI TRNSMITTER (U26.32)
NetR115_1: 07-ZYNQ BANK 502 (U2.L2), 08-DDR3-256MX32 (R115.1 U20.G9)
NetR115_2: 07-ZYNQ BANK 502 (U2.M2), 08-DDR3-256MX32 (R115.2 U20.G10)
NetR180_1: 09-PL BANKS 34 & 35 (U2.B19), 11-DSP PROCESSOR 1-OF-3 (R180.1 U23.U18)
NetR180_2: 09-PL BANKS 34 & 35 (U2.A20), 11-DSP PROCESSOR 1-OF-3 (R180.2 U23.T18)
NetR181_1: 09-PL BANKS 34 & 35 (U2.C20), 11-DSP PROCESSOR 1-OF-3 (R181.1 U23.T17)
NetR181_2: 09-PL BANKS 34 & 35 (U2.B20), 11-DSP PROCESSOR 1-OF-3 (R181.2 U23.R17)
NetR182_1: 09-PL BANKS 34 & 35 (U2.D19), 11-DSP PROCESSOR 1-OF-3 (R182.1 U23.R16)
NetR182_2: 09-PL BANKS 34 & 35 (U2.D20), 11-DSP PROCESSOR 1-OF-3 (R182.2 U23.P16)
NetR183_1: 09-PL BANKS 34 & 35 (U2.E18), 11-DSP PROCESSOR 1-OF-3 (R183.1 U23.P15)
NetR183_2: 09-PL BANKS 34 & 35 (U2.E19), 11-DSP PROCESSOR 1-OF-3 (R183.2 U23.N15)
NetR184_1: 09-PL BANKS 34 & 35 (U2.E17), 11-DSP PROCESSOR 1-OF-3 (R184.1 U23.R18)
NetR184_2: 09-PL BANKS 34 & 35 (U2.D18), 11-DSP PROCESSOR 1-OF-3 (R184.2 U23.P18)
NetR185_1: 09-PL BANKS 34 & 35 (U2.F19), 11-DSP PROCESSOR 1-OF-3 (R185.1 U23.P17)
NetR185_2: 09-PL BANKS 34 & 35 (U2.F20), 11-DSP PROCESSOR 1-OF-3 (R185.2 U23.N17)
NetR186_1: 09-PL BANKS 34 & 35 (U2.G17), 11-DSP PROCESSOR 1-OF-3 (R186.1 U23.N16)
NetR186_2: 09-PL BANKS 34 & 35 (U2.G18), 11-DSP PROCESSOR 1-OF-3 (R186.2 U23.M16)
NetR187_1: 09-PL BANKS 34 & 35 (U2.G19), 11-DSP PROCESSOR 1-OF-3 (R187.1 U23.M15)
NetR187_2: 09-PL BANKS 34 & 35 (U2.G20), 11-DSP PROCESSOR 1-OF-3 (R187.2 U23.L15)
NetR188_1: 09-PL BANKS 34 & 35 (U2.H15), 11-DSP PROCESSOR 1-OF-3 (R188.1 U23.M17)
NetR188_2: 09-PL BANKS 34 & 35 (U2.G15), 11-DSP PROCESSOR 1-OF-3 (R188.2 U23.L17)
NetR189_1: 09-PL BANKS 34 & 35 (U2.F16), 11-DSP PROCESSOR 1-OF-3 (R189.1 U23.N18)
NetR189_2: 09-PL BANKS 34 & 35 (U2.F17), 11-DSP PROCESSOR 1-OF-3 (R189.2 U23.M18)
NetR190_1: 09-PL BANKS 34 & 35 (U2.K14), 11-DSP PROCESSOR 1-OF-3 (R190.1 U23.H17)
NetR190_2: 09-PL BANKS 34 & 35 (U2.J14), 11-DSP PROCESSOR 1-OF-3 (R190.2 U23.G17)
NetR191_1: 09-PL BANKS 34 & 35 (U2.K16), 11-DSP PROCESSOR 1-OF-3 (R191.1 U23.J16)
NetR191_2: 09-PL BANKS 34 & 35 (U2.J16), 11-DSP PROCESSOR 1-OF-3 (R191.2 U23.H16)
NetR192_1: 09-PL BANKS 34 & 35 (U2.H16), 13-DSP PROCESSOR 3-OF-3 (R192.1 U23.J1)
NetR192_2: 09-PL BANKS 34 & 35 (U2.H17), 13-DSP PROCESSOR 3-OF-3 (R192.2 U23.K1)
NetR295_2: 05-GIGE PORT (U9.12), 06-USB PORTS (U12.27 U17.27), 17-RESET GENERATION (R295.2 U33.4)
NetR296_2: 04-ZYNQ BANK 501 (R296.2), 05-GIGE PORT (U9.2)
NetR297_1: 04-ZYNQ BANK 501 (U2.D13), 05-GIGE PORT (R297.1)
NetR317_2: 07-ZYNQ BANK 502 (R317.2), 08-DDR3-256MX32 (U20.H2)
NetR318_2: 07-ZYNQ BANK 502 (R318.2), 08-DDR3-256MX32 (U20.K12)
NetR319_2: 07-ZYNQ BANK 502 (R319.2), 08-DDR3-256MX32 (U20.K1)
NetR320_2: 07-ZYNQ BANK 502 (R320.2), 08-DDR3-256MX32 (U20.H3)
NetR321_2: 07-ZYNQ BANK 502 (R321.2), 08-DDR3-256MX32 (U20.H4)
NetR322_2: 07-ZYNQ BANK 502 (R322.2), 08-DDR3-256MX32 (U20.J4)
NetR323_2: 07-ZYNQ BANK 502 (R323.2), 08-DDR3-256MX32 (U20.G3)
NetR324_2: 07-ZYNQ BANK 502 (R324.2), 08-DDR3-256MX32 (U20.G4)
NetR325_2: 07-ZYNQ BANK 502 (R325.2), 08-DDR3-256MX32 (U20.G11)
NetU2_A1: 07-ZYNQ BANK 502 (U2.A1), 08-DDR3-256MX32 (U20.C4)
NetU2_A9: 04-ZYNQ BANK 501 (U2.A9), 06-USB PORTS (U17.2)
NetU2_A11: 04-ZYNQ BANK 501 (U2.A11), 06-USB PORTS (U12.1)
NetU2_B2: 07-ZYNQ BANK 502 (U2.B2), 08-DDR3-256MX32 (U20.D4)
NetU2_B12: 04-ZYNQ BANK 501 (U2.B12), 06-USB PORTS (U17.1)
NetU2_C2: 07-ZYNQ BANK 502 (U2.C2), 08-DDR3-256MX32 (U20.D3)
NetU2_C13: 04-ZYNQ BANK 501 (U2.C13), 06-USB PORTS (U12.31)
NetU2_C15: 04-ZYNQ BANK 501 (U2.C15), 06-USB PORTS (U12.29)
NetU2_C17: 04-ZYNQ BANK 501 (U2.C17), 06-USB PORTS (U17.31)
NetU2_E12: 04-ZYNQ BANK 501 (U2.E12), 06-USB PORTS (U17.29)
NetU2_E16: 04-ZYNQ BANK 501 (U2.E16), 06-USB PORTS (U12.2)
NetU2_F1: 07-ZYNQ BANK 502 (U2.F1), 08-DDR3-256MX32 (U20.C9)
NetU2_F2: 07-ZYNQ BANK 502 (U2.F2), 08-DDR3-256MX32 (U20.D9)
NetU2_G2: 07-ZYNQ BANK 502 (U2.G2), 08-DDR3-256MX32 (U20.D10)
NetU2_H18: 09-PL BANKS 34 & 35 (U2.H18), 11-DSP PROCESSOR 1-OF-3 (U23.K16)
NetU2_H20: 09-PL BANKS 34 & 35 (U2.H20), 11-DSP PROCESSOR 1-OF-3 (U23.J15)
NetU2_J15: 09-PL BANKS 34 & 35 (U2.J15), 11-DSP PROCESSOR 1-OF-3 (U38.8)
NetU2_J18: 09-PL BANKS 34 & 35 (U2.J18), 11-DSP PROCESSOR 1-OF-3 (U23.L16)
NetU2_J19: 09-PL BANKS 34 & 35 (U2.J19), 11-DSP PROCESSOR 1-OF-3 (U23.G15)
NetU2_J20: 09-PL BANKS 34 & 35 (U2.J20), 11-DSP PROCESSOR 1-OF-3 (U23.K15)
NetU2_K17: 09-PL BANKS 34 & 35 (U2.K17), 11-DSP PROCESSOR 1-OF-3 (U23.G18)
NetU2_K18: 09-PL BANKS 34 & 35 (U2.K18), 11-DSP PROCESSOR 1-OF-3 (U23.F18)
NetU2_K19: 09-PL BANKS 34 & 35 (U2.K19), 11-DSP PROCESSOR 1-OF-3 (U23.H15)
NetU2_L14: 09-PL BANKS 34 & 35 (U2.L14), 11-DSP PROCESSOR 1-OF-3 (U23.G16)
NetU2_L15: 09-PL BANKS 34 & 35 (U2.L15), 11-DSP PROCESSOR 1-OF-3 (U23.F16)
NetU2_L16: 09-PL BANKS 34 & 35 (U2.L16), 11-DSP PROCESSOR 1-OF-3 (U23.F17)
NetU2_L17: 09-PL BANKS 34 & 35 (U2.L17), 11-DSP PROCESSOR 1-OF-3 (U23.E17)
NetU2_L19: 09-PL BANKS 34 & 35 (U2.L19), 11-DSP PROCESSOR 1-OF-3 (U23.F15)
NetU2_L20: 09-PL BANKS 34 & 35 (U2.L20), 11-DSP PROCESSOR 1-OF-3 (U23.E15)
NetU2_M14: 09-PL BANKS 34 & 35 (U2.M14), 11-DSP PROCESSOR 1-OF-3 (U23.E18)
NetU2_M15: 09-PL BANKS 34 & 35 (U2.M15), 11-DSP PROCESSOR 1-OF-3 (U23.D18)
NetU2_M17: 09-PL BANKS 34 & 35 (U2.M17), 11-DSP PROCESSOR 1-OF-3 (U23.D17)
NetU2_M18: 09-PL BANKS 34 & 35 (U2.M18), 11-DSP PROCESSOR 1-OF-3 (U23.C17)
NetU2_M19: 09-PL BANKS 34 & 35 (U2.M19), 11-DSP PROCESSOR 1-OF-3 (U23.E16)
NetU2_M20: 09-PL BANKS 34 & 35 (U2.M20), 11-DSP PROCESSOR 1-OF-3 (U23.D16)
NetU2_N15: 09-PL BANKS 34 & 35 (U2.N15), 11-DSP PROCESSOR 1-OF-3 (U23.C18)
NetU2_N16: 09-PL BANKS 34 & 35 (U2.N16), 11-DSP PROCESSOR 1-OF-3 (U23.B18)
NetU2_R2: 07-ZYNQ BANK 502 (U2.R2), 08-DDR3-256MX32 (U20.P10)
NetU2_T1: 07-ZYNQ BANK 502 (U2.T1), 08-DDR3-256MX32 (U20.R9)
NetU2_T2: 07-ZYNQ BANK 502 (U2.T2), 08-DDR3-256MX32 (U20.P9)
NetU2_W4: 07-ZYNQ BANK 502 (U2.W4), 08-DDR3-256MX32 (U20.P4)
NetU2_W5: 07-ZYNQ BANK 502 (U2.W5), 08-DDR3-256MX32 (U20.P3)
NetU2_Y1: 07-ZYNQ BANK 502 (U2.Y1), 08-DDR3-256MX32 (U20.R4)
UART_RX: 03-ZYNQ BANK 500 (J2.2 R40.2 U5.3), 17-RESET GENERATION (J13.24)
UART_TX: 03-ZYNQ BANK 500 (J2.1 U5.6), 17-RESET GENERATION (J13.26)